# EAGLE design witch-phase2a (EAGLE 6.4)

## Sheet 1 of 7
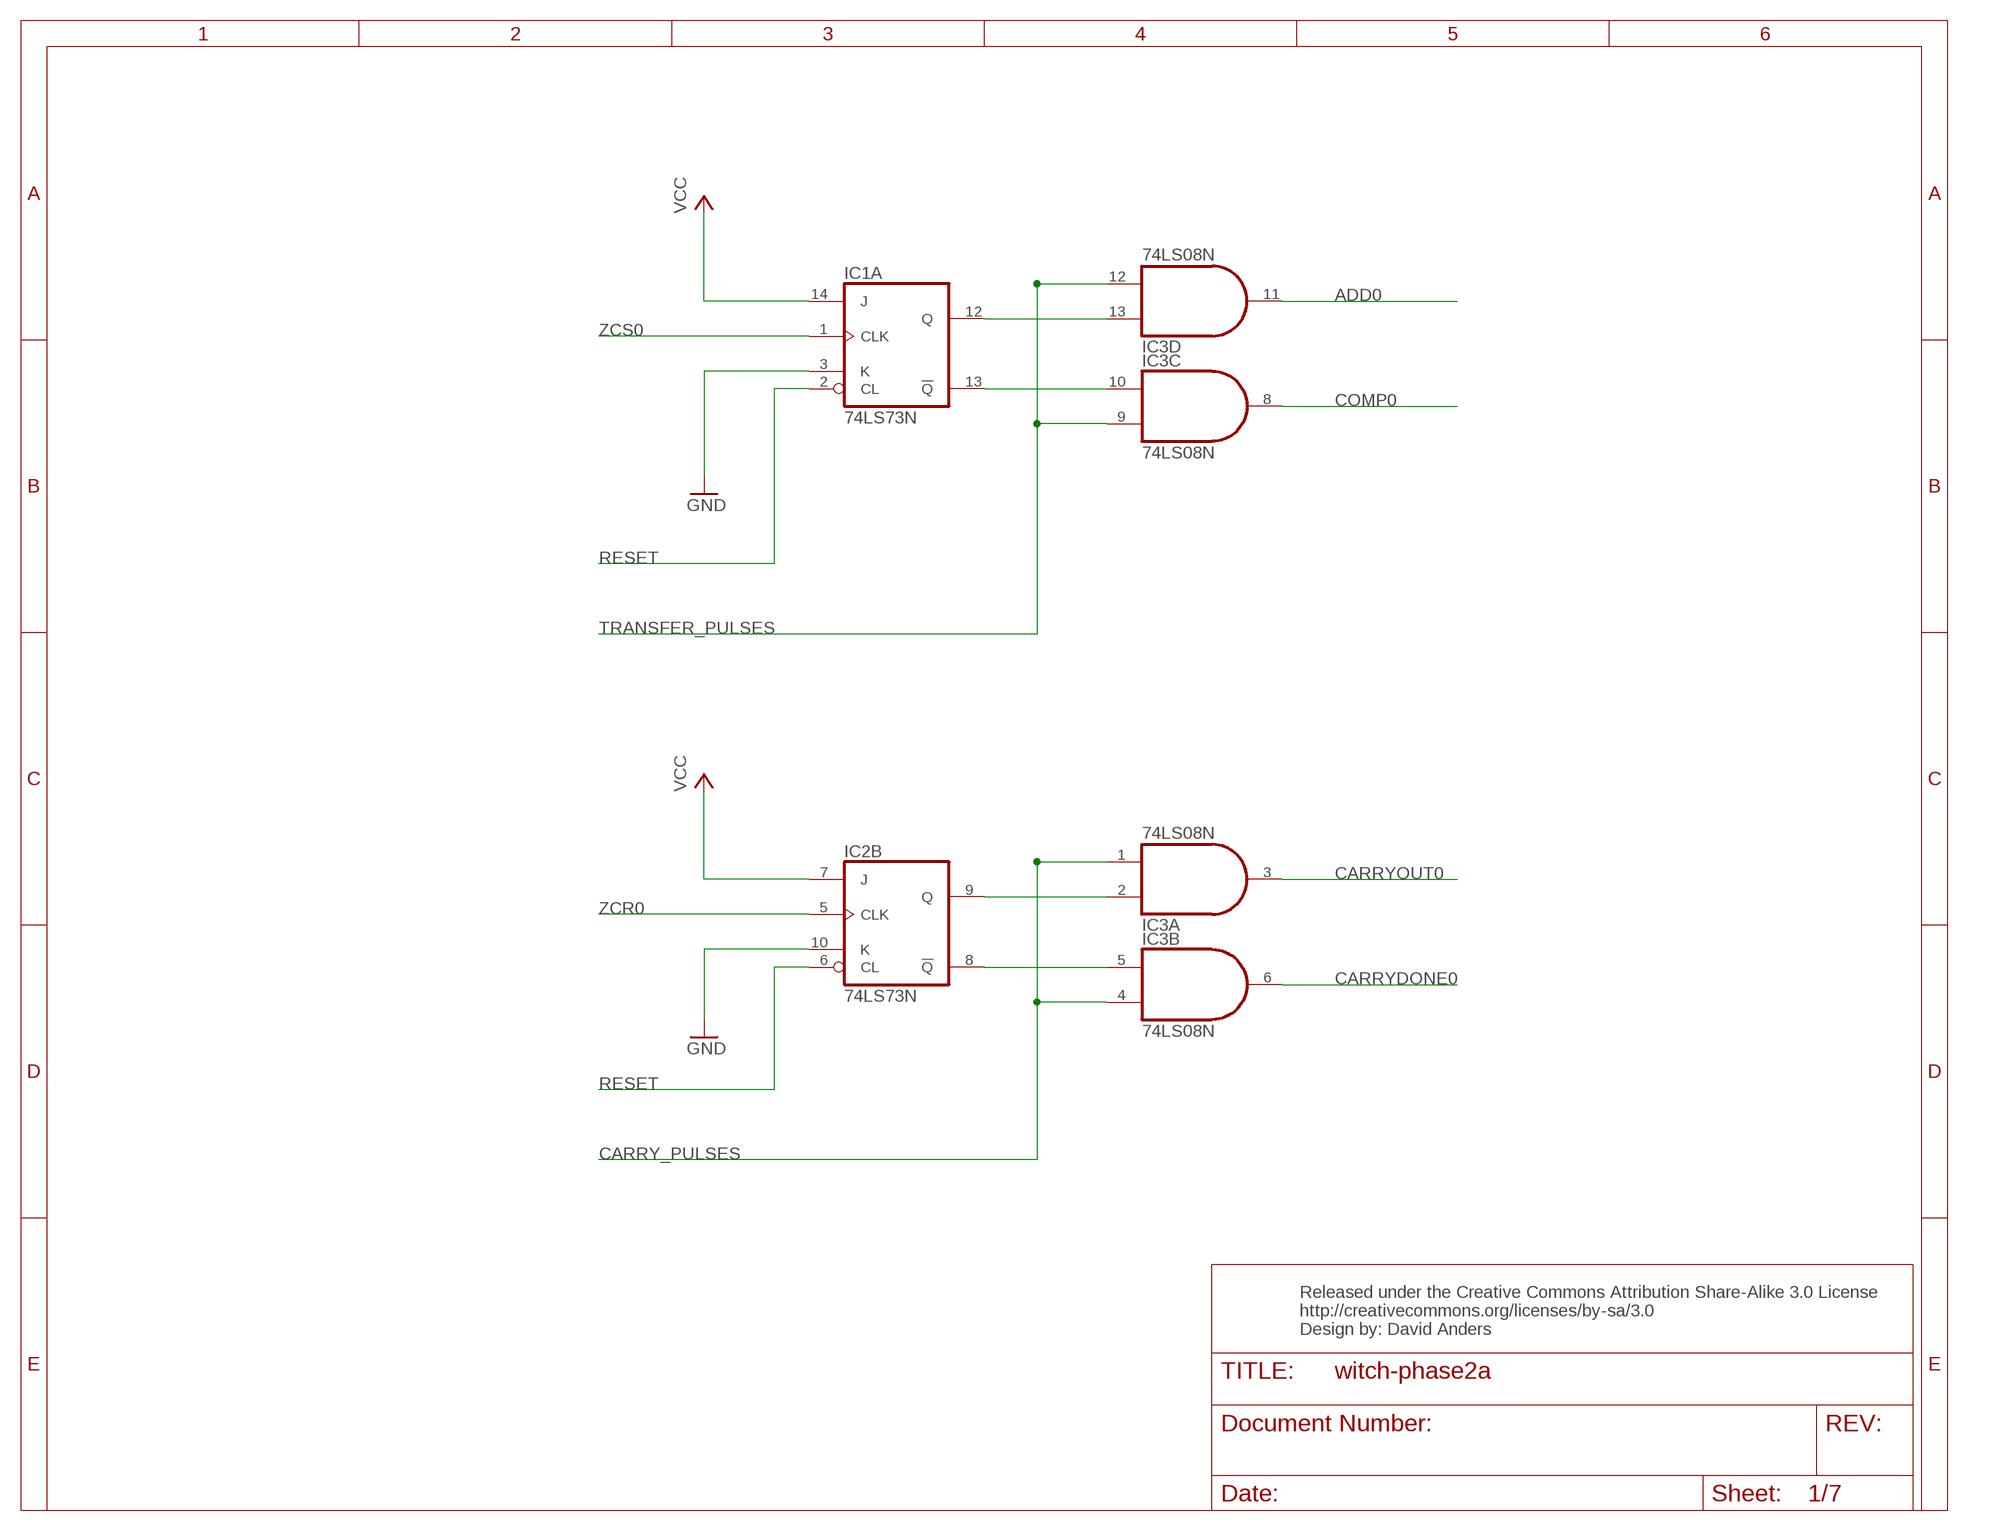
[diagram p0: schematic, sheet 1]

### Parts
IC1  74LS73N  [DIL14]
IC2  74LS73N  [DIL14]
IC3  74LS08N  [DIL14]

### Nets
ADD0: IC3.11(D:O) ; also sheet 6
CARRY_PULSES: IC3.1(A:I0) IC3.4(B:I0) ; also sheet 2,3,4,7
CARRYDONE0: IC3.6(B:O) ; also sheet 7
CARRYOUT0: IC3.3(A:O) ; also sheet 6
COMP0: IC3.8(C:O) ; also sheet 5,6
GND: IC1.3(A:K) IC2.10(B:K) ; also sheet 2,3,4,5,6,7
N$1: IC2.9(B:Q) IC3.2(A:I1)
N$2: IC2.8(B:!Q) IC3.5(B:I1)
N$4: IC1.12(A:Q) IC3.13(D:I1)
N$5: IC1.13(A:!Q) IC3.10(C:I1)
RESET: IC1.2(A:CL) IC2.6(B:CL) ; also sheet 2,3,4,7
TRANSFER_PULSES: IC3.9(C:I0) IC3.12(D:I0) ; also sheet 2,3,4,7
VCC: IC1.14(A:J) IC2.7(B:J) ; also sheet 2,3,4,5,6,7
ZCR0: IC2.5(B:CLK) ; also sheet 6
ZCS0: IC1.1(A:CLK) ; also sheet 5

### Notes on the sheet
- Released under the Creative Commons Attribution Share-Alike 3.0 License
  http://creativecommons.org/licenses/by-sa/3.0
  Design by: David Anders

## Sheet 2 of 7
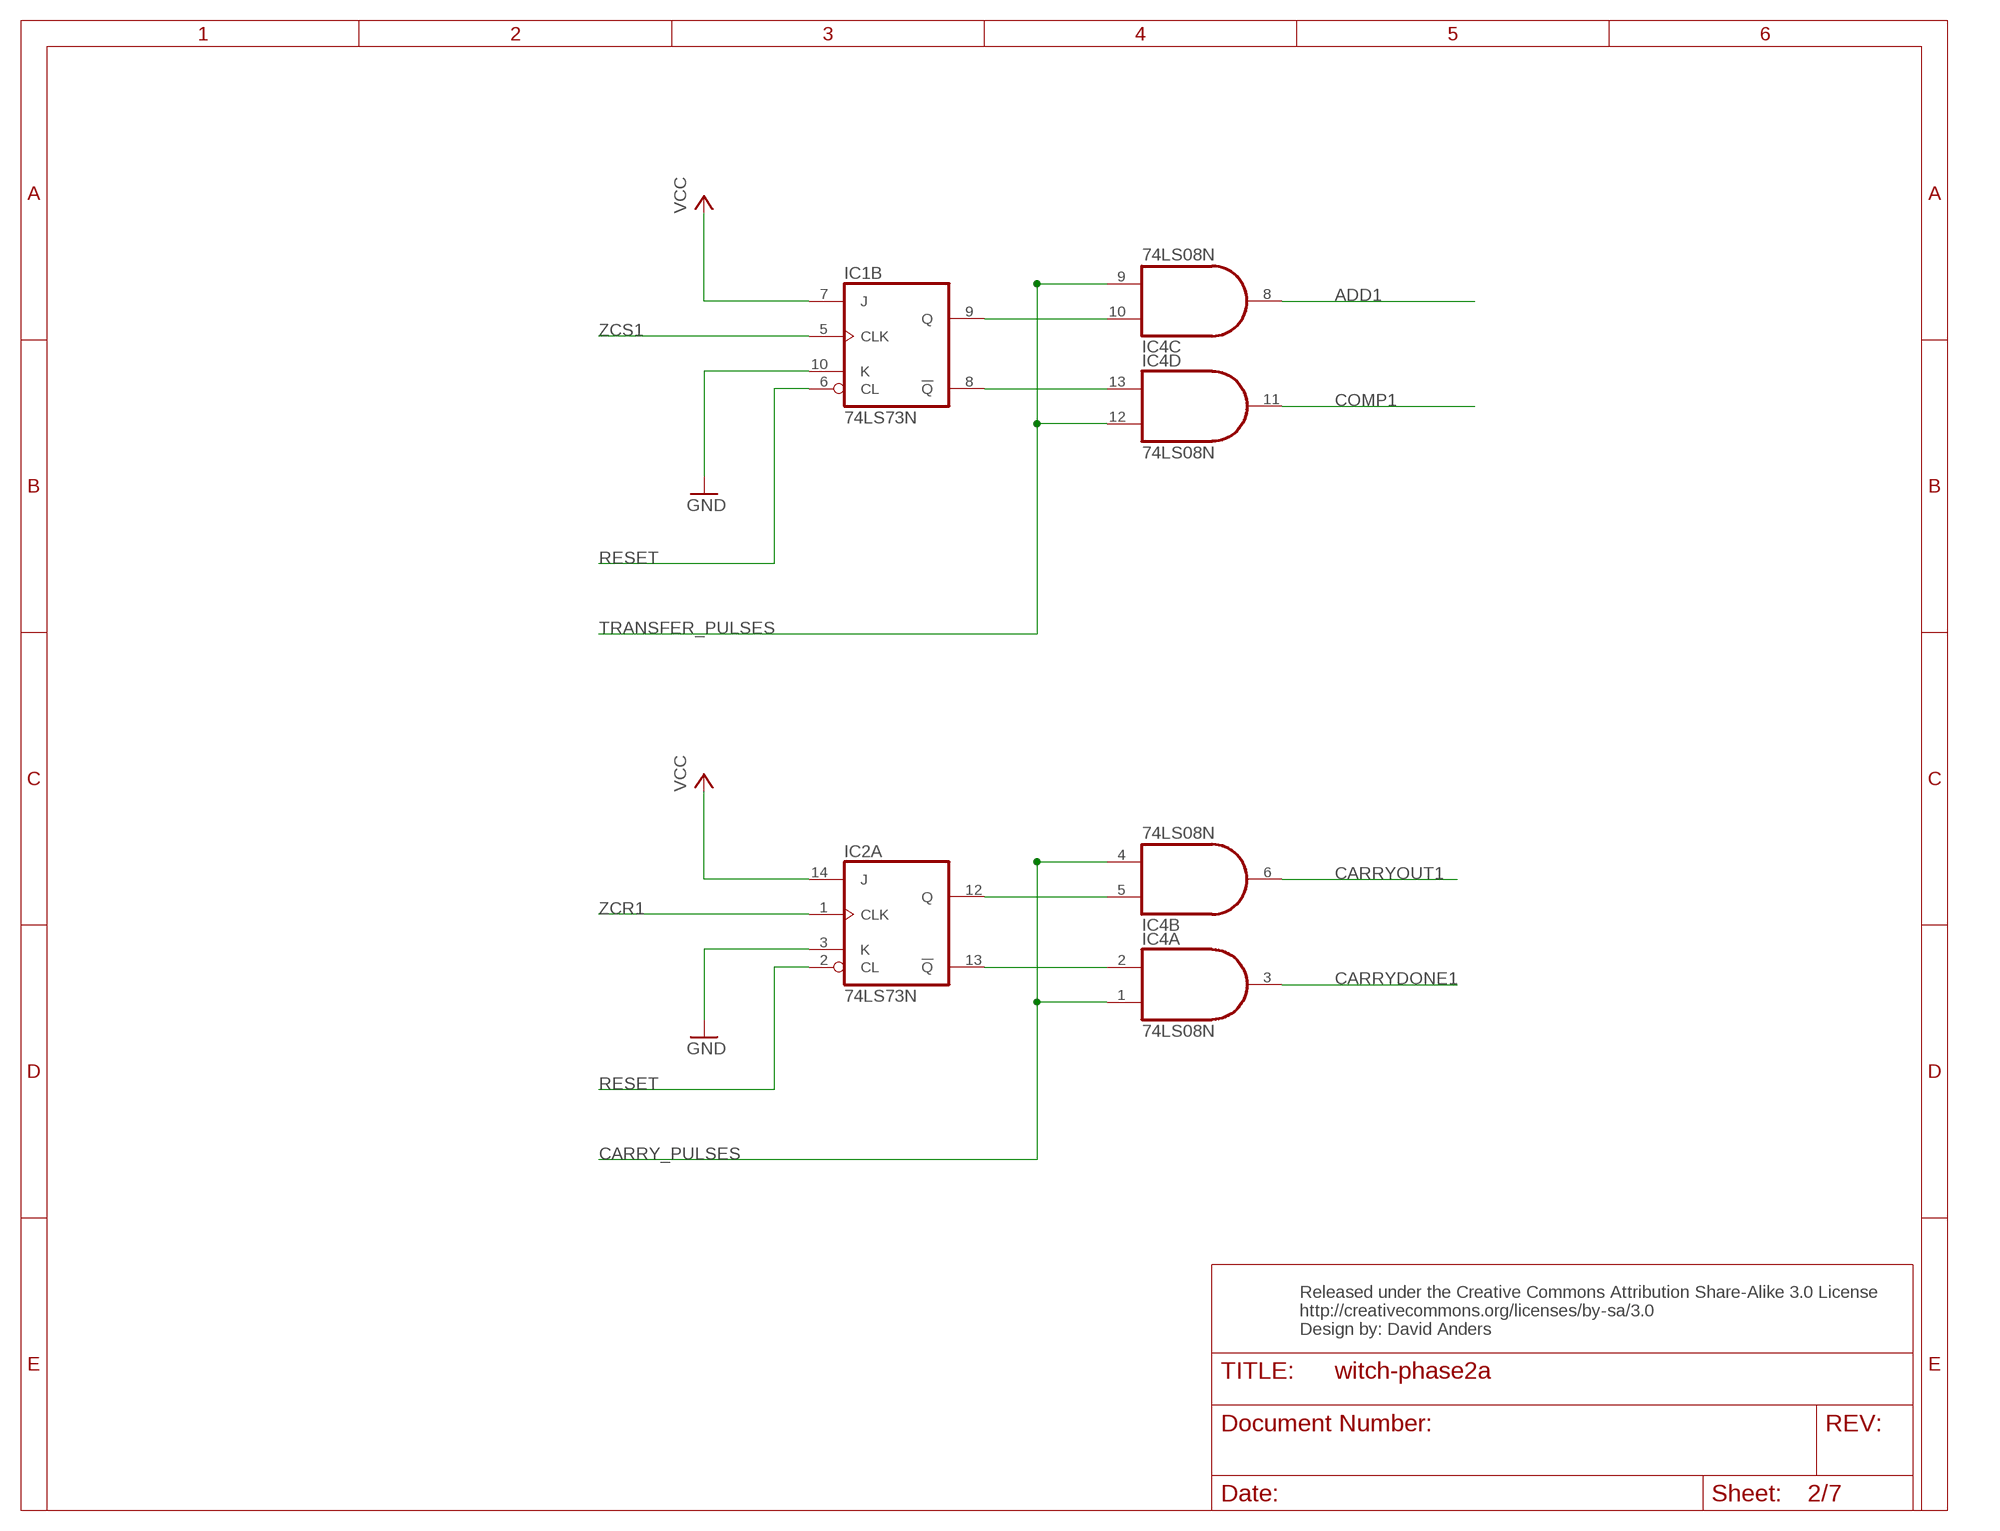
[diagram p1: schematic, sheet 2]

### Parts
IC4  74LS08N  [DIL14]

### Nets
ADD1: IC4.8(C:O) ; also sheet 6
CARRY_PULSES: IC4.1(A:I0) IC4.4(B:I0) ; also sheet 1,3,4,7
CARRYDONE1: IC4.3(A:O) ; also sheet 7
CARRYOUT1: IC4.6(B:O) ; also sheet 6
COMP1: IC4.11(D:O) ; also sheet 5,6
GND: IC1.10(B:K) IC2.3(A:K) ; also sheet 1,3,4,5,6,7
N$3: IC2.12(A:Q) IC4.5(B:I1)
N$6: IC2.13(A:!Q) IC4.2(A:I1)
N$7: IC1.8(B:!Q) IC4.13(D:I1)
N$8: IC1.9(B:Q) IC4.10(C:I1)
RESET: IC1.6(B:CL) IC2.2(A:CL) ; also sheet 1,3,4,7
TRANSFER_PULSES: IC4.9(C:I0) IC4.12(D:I0) ; also sheet 1,3,4,7
VCC: IC1.7(B:J) IC2.14(A:J) ; also sheet 1,3,4,5,6,7
ZCR1: IC2.1(A:CLK) ; also sheet 6
ZCS1: IC1.5(B:CLK) ; also sheet 5

### Notes on the sheet
- Released under the Creative Commons Attribution Share-Alike 3.0 License
  http://creativecommons.org/licenses/by-sa/3.0
  Design by: David Anders

## Sheet 3 of 7
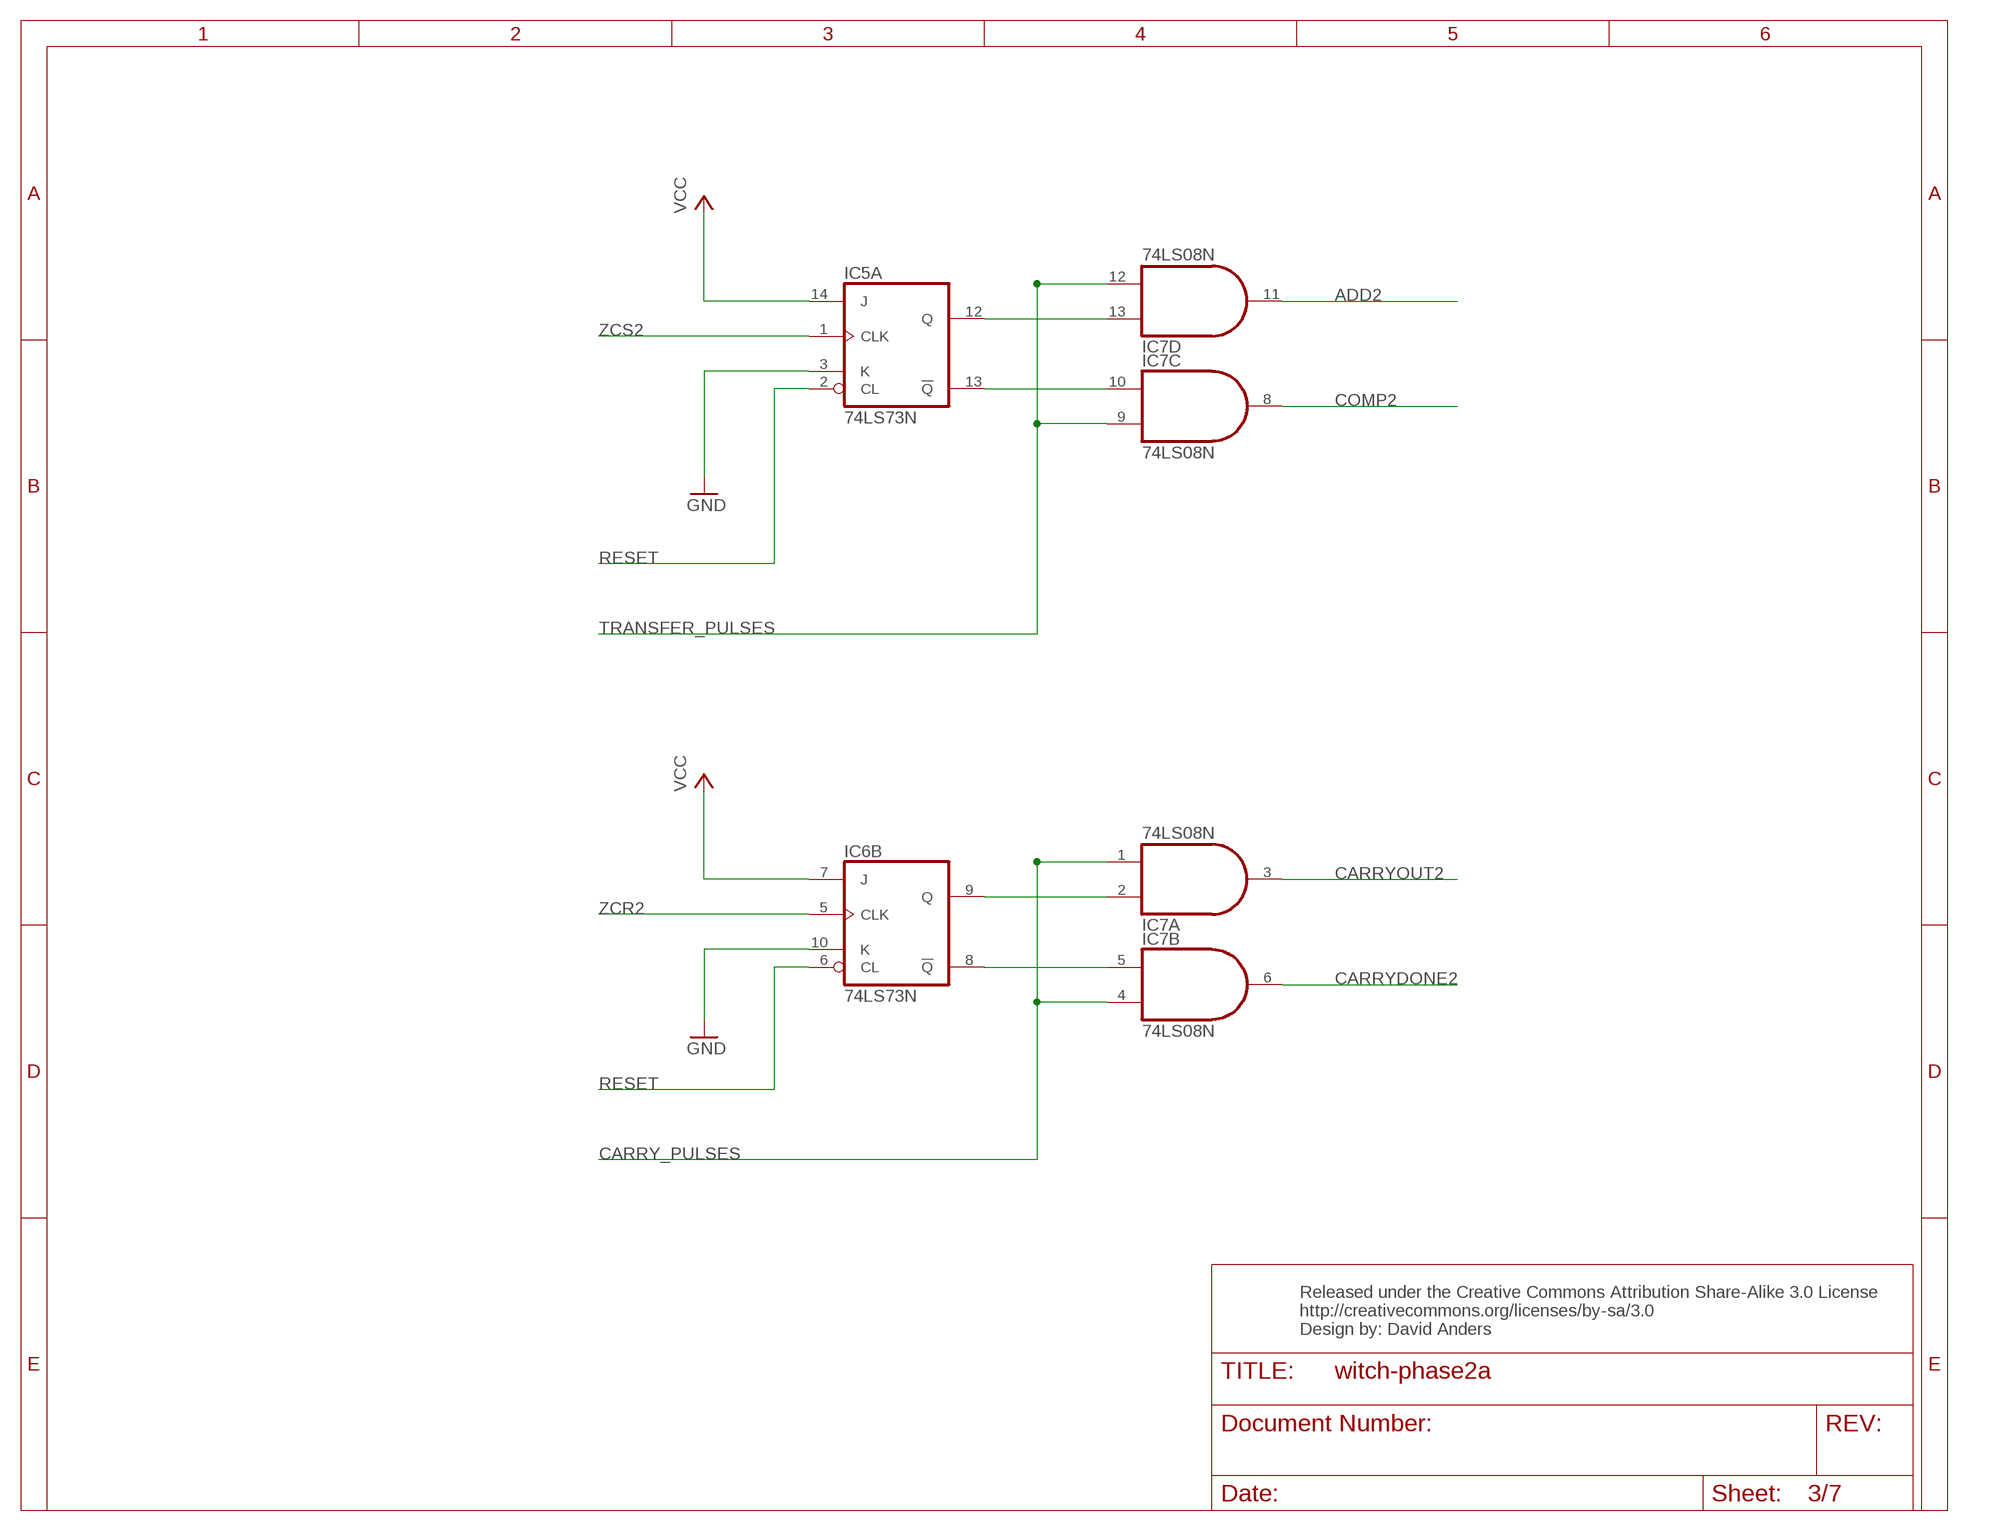
[diagram p2: schematic, sheet 3]

### Parts
IC5  74LS73N  [DIL14]
IC6  74LS73N  [DIL14]
IC7  74LS08N  [DIL14]

### Nets
ADD2: IC7.11(D:O) ; also sheet 6
CARRY_PULSES: IC7.1(A:I0) IC7.4(B:I0) ; also sheet 1,2,4,7
CARRYDONE2: IC7.6(B:O) ; also sheet 7
CARRYOUT2: IC7.3(A:O) ; also sheet 6
COMP2: IC7.8(C:O) ; also sheet 5,6
GND: IC5.3(A:K) IC6.10(B:K) ; also sheet 1,2,4,5,6,7
N$9: IC6.8(B:!Q) IC7.5(B:I1)
N$10: IC5.13(A:!Q) IC7.10(C:I1)
N$11: IC5.12(A:Q) IC7.13(D:I1)
N$12: IC6.9(B:Q) IC7.2(A:I1)
RESET: IC5.2(A:CL) IC6.6(B:CL) ; also sheet 1,2,4,7
TRANSFER_PULSES: IC7.9(C:I0) IC7.12(D:I0) ; also sheet 1,2,4,7
VCC: IC5.14(A:J) IC6.7(B:J) ; also sheet 1,2,4,5,6,7
ZCR2: IC6.5(B:CLK) ; also sheet 6
ZCS2: IC5.1(A:CLK) ; also sheet 5

### Notes on the sheet
- Released under the Creative Commons Attribution Share-Alike 3.0 License
  http://creativecommons.org/licenses/by-sa/3.0
  Design by: David Anders

## Sheet 4 of 7
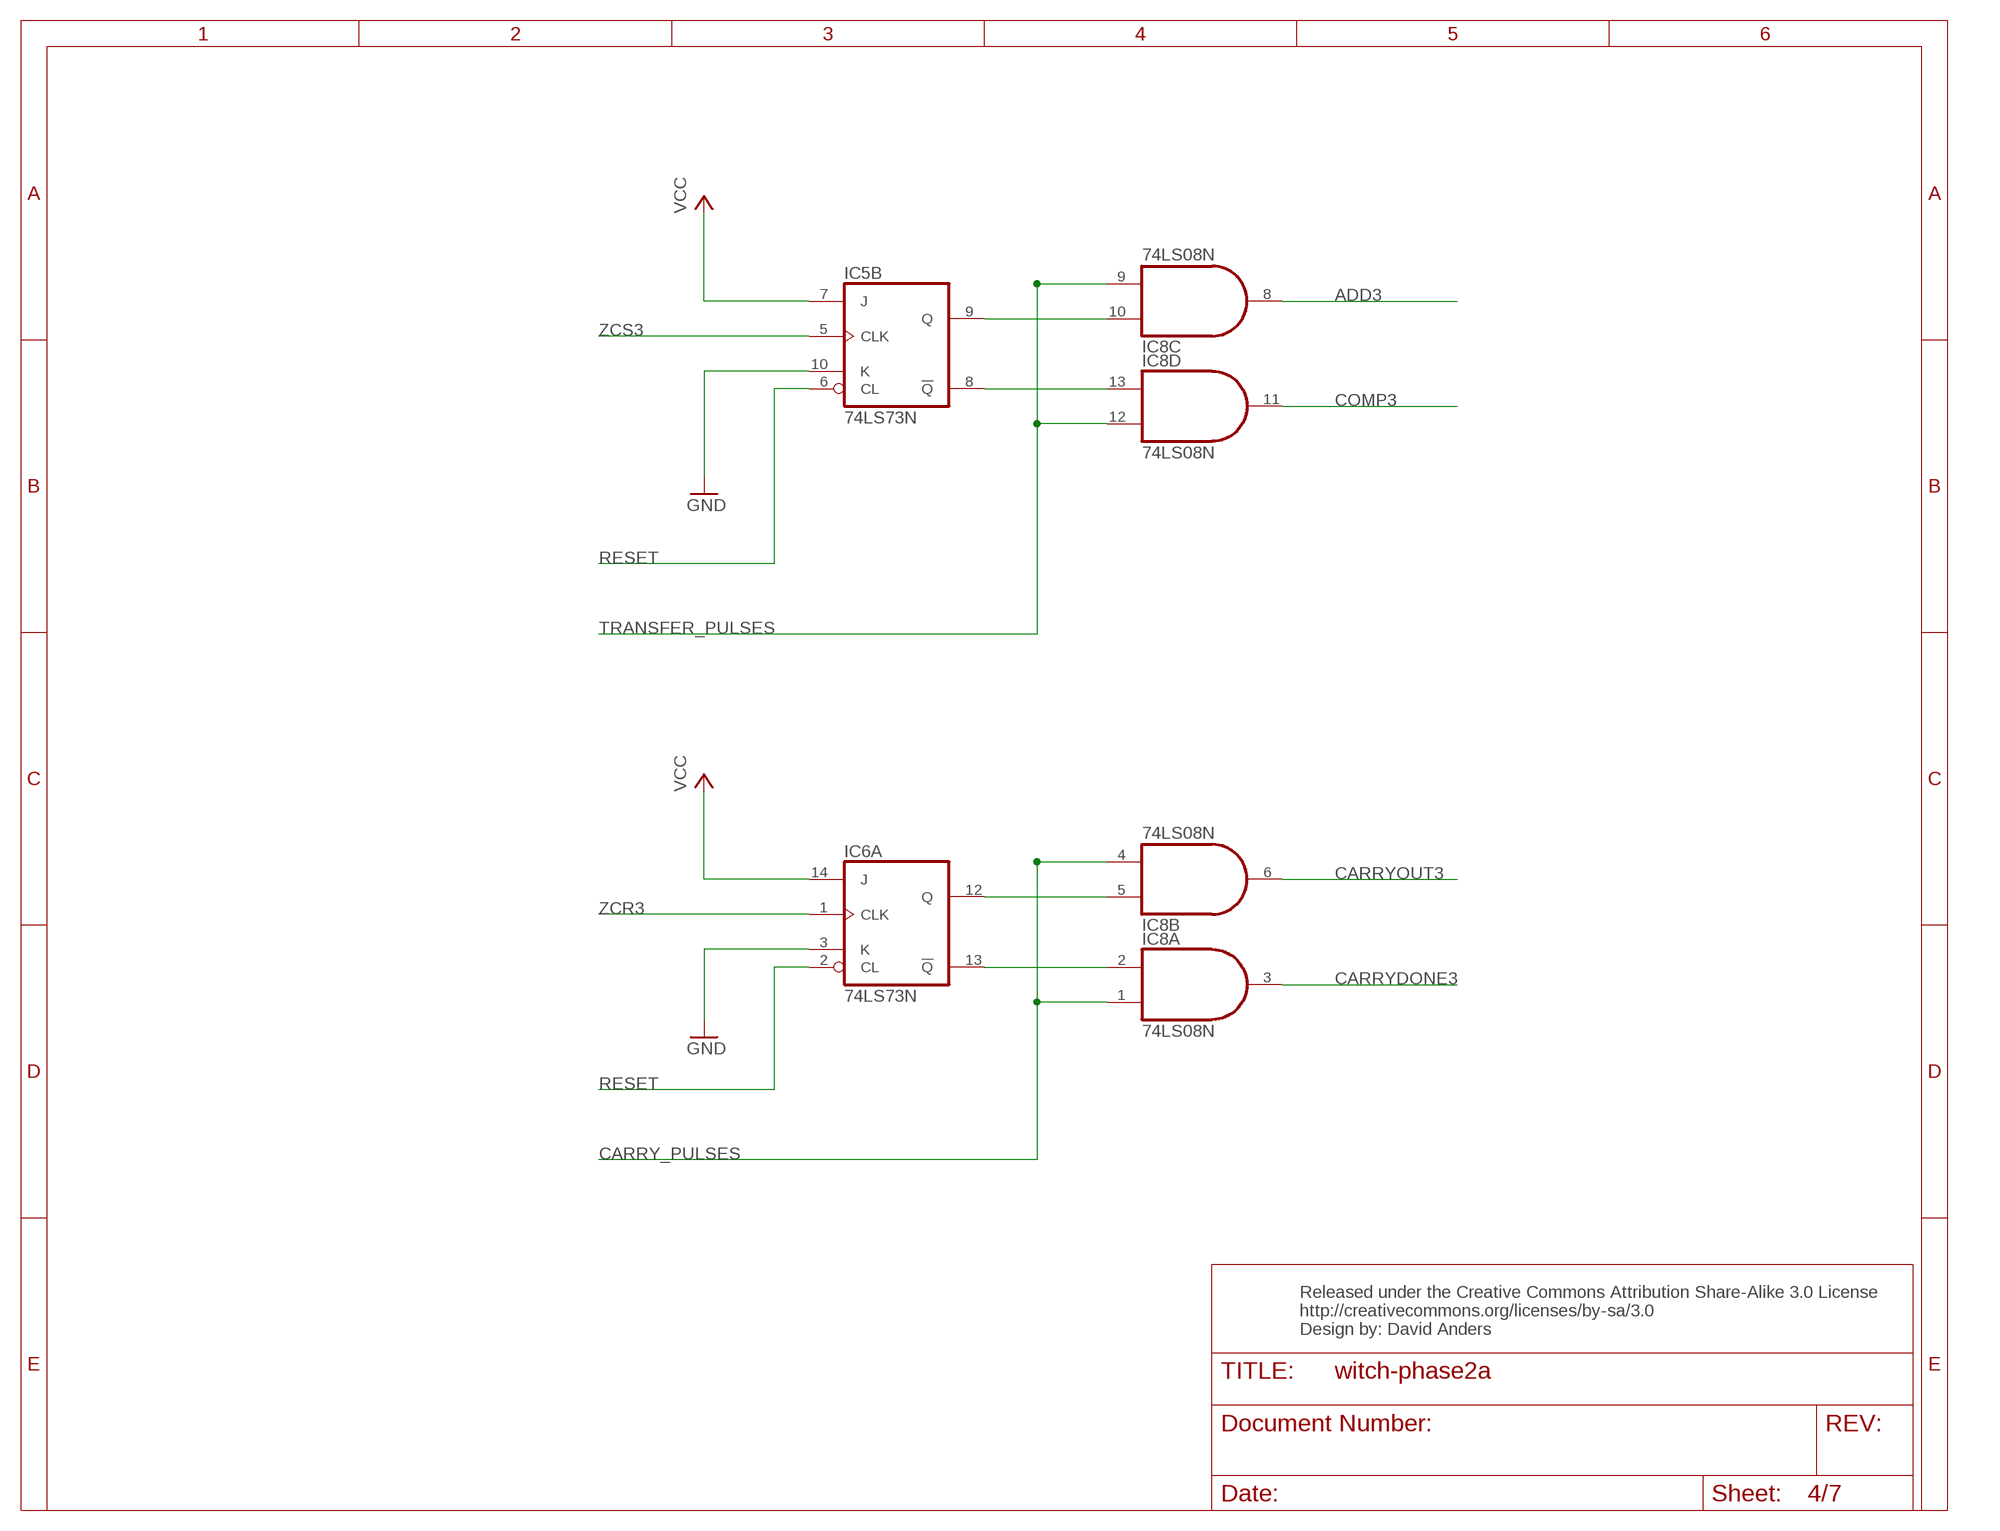
[diagram p3: schematic, sheet 4]

### Parts
IC8  74LS08N  [DIL14]

### Nets
ADD3: IC8.8(C:O) ; also sheet 6
CARRY_PULSES: IC8.1(A:I0) IC8.4(B:I0) ; also sheet 1,2,3,7
CARRYDONE3: IC8.3(A:O) ; also sheet 7
CARRYOUT3: IC8.6(B:O) ; also sheet 6
COMP3: IC8.11(D:O) ; also sheet 5,6
GND: IC5.10(B:K) IC6.3(A:K) ; also sheet 1,2,3,5,6,7
N$13: IC6.13(A:!Q) IC8.2(A:I1)
N$14: IC5.8(B:!Q) IC8.13(D:I1)
N$15: IC5.9(B:Q) IC8.10(C:I1)
N$16: IC6.12(A:Q) IC8.5(B:I1)
RESET: IC5.6(B:CL) IC6.2(A:CL) ; also sheet 1,2,3,7
TRANSFER_PULSES: IC8.9(C:I0) IC8.12(D:I0) ; also sheet 1,2,3,7
VCC: IC5.7(B:J) IC6.14(A:J) ; also sheet 1,2,3,5,6,7
ZCR3: IC6.1(A:CLK) ; also sheet 6
ZCS3: IC5.5(B:CLK) ; also sheet 5

### Notes on the sheet
- Released under the Creative Commons Attribution Share-Alike 3.0 License
  http://creativecommons.org/licenses/by-sa/3.0
  Design by: David Anders

## Sheet 5 of 7
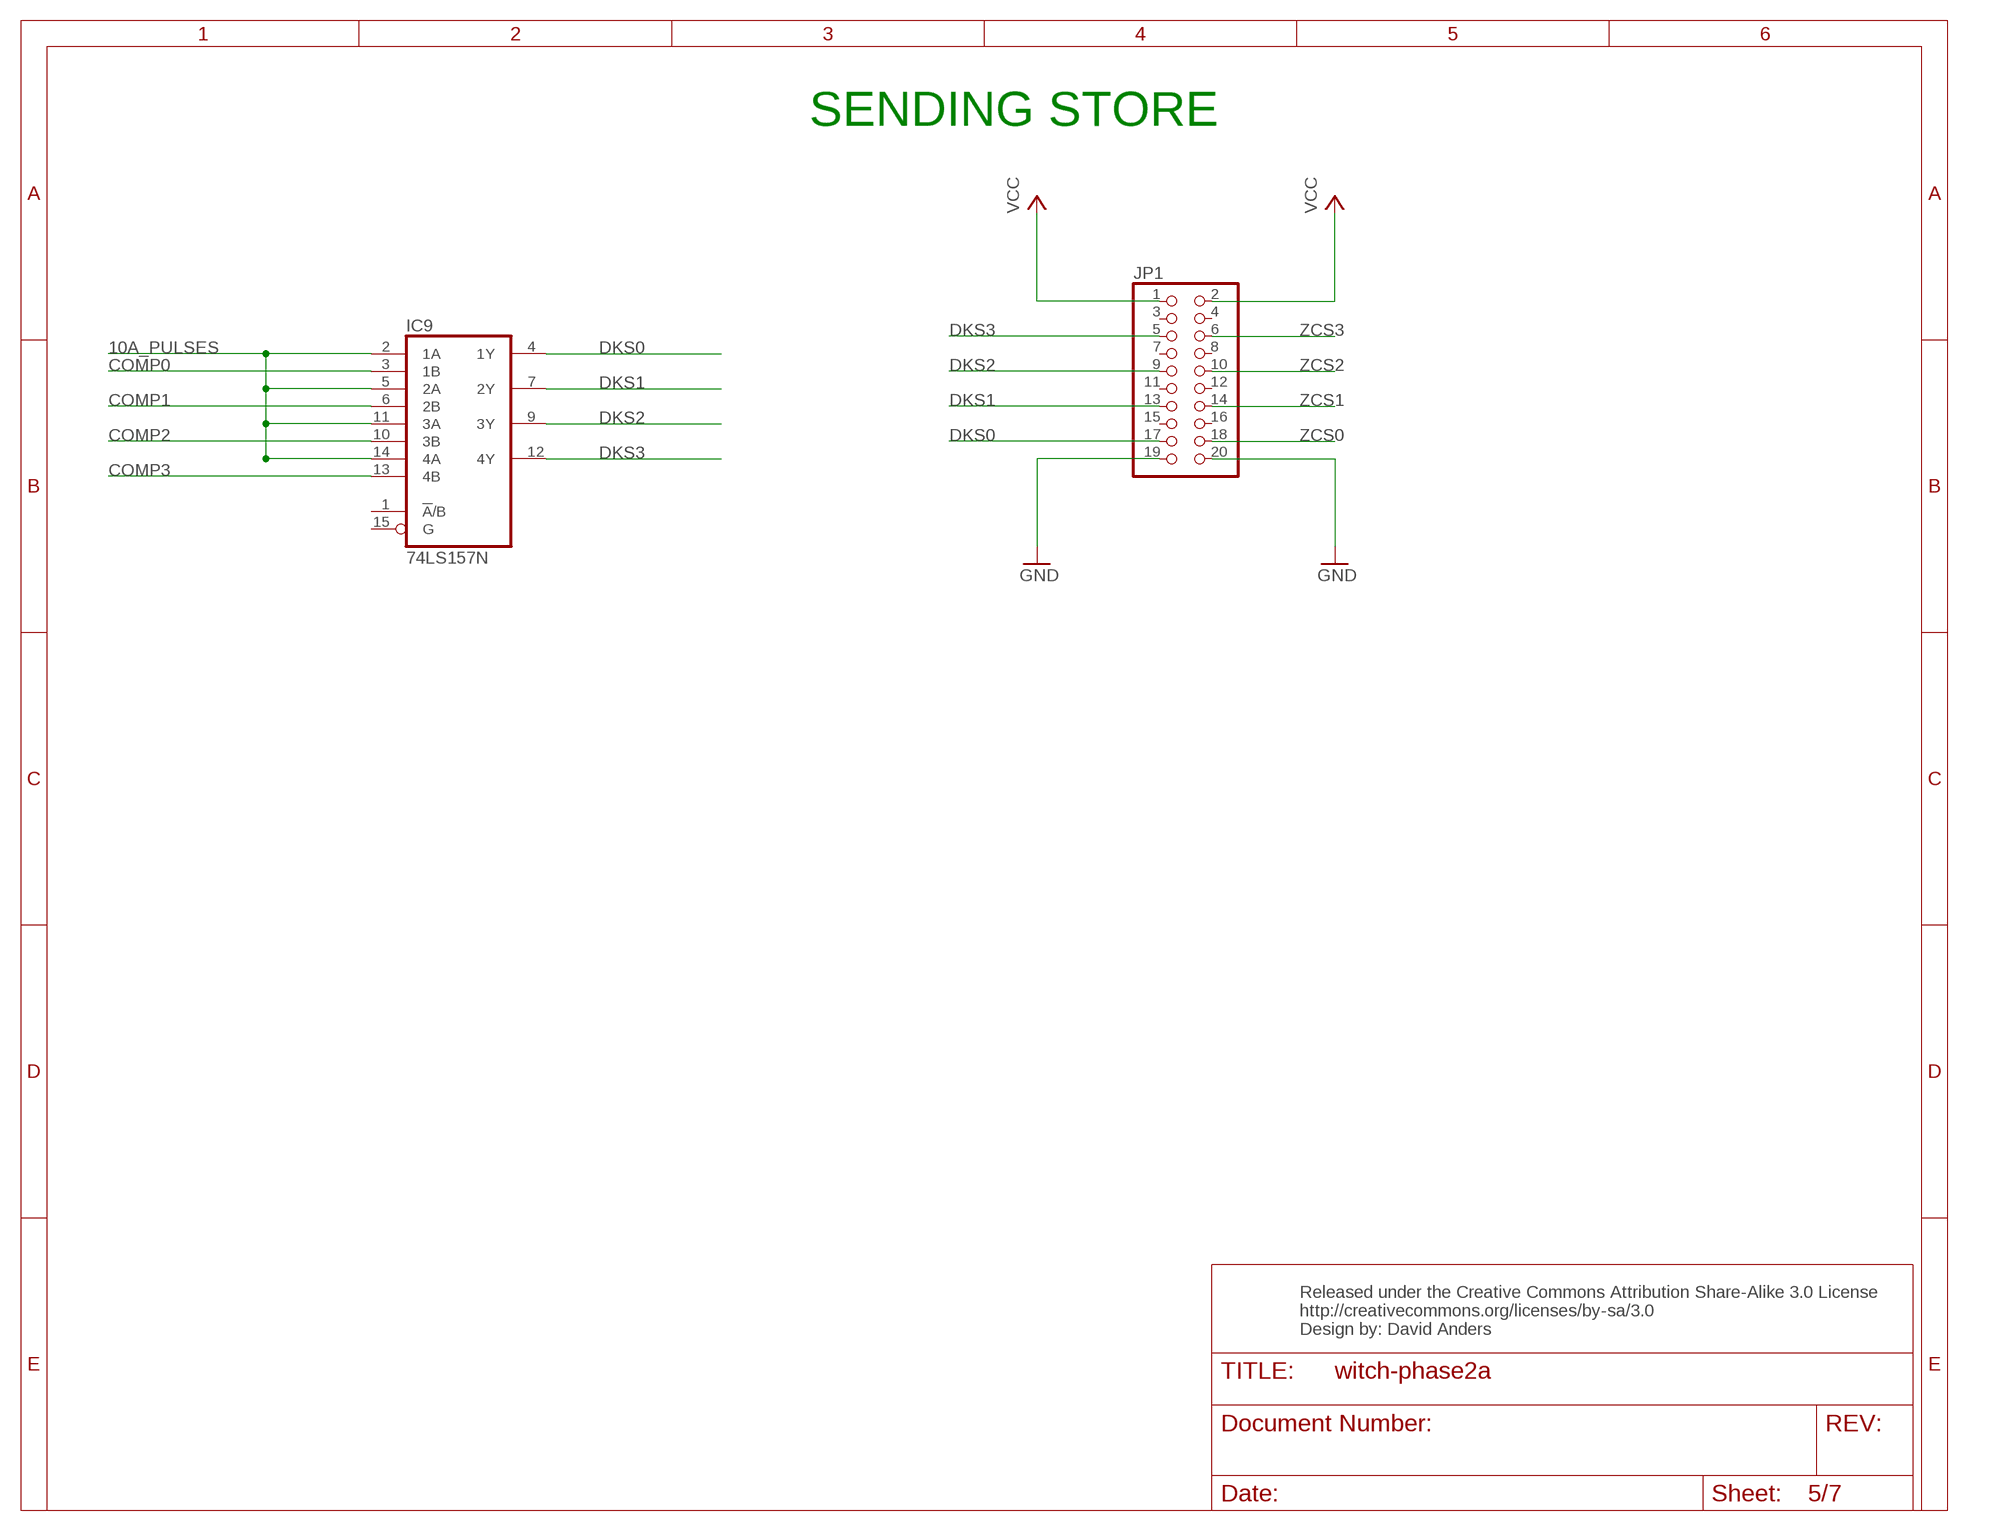
[diagram p4: schematic, sheet 5]

### Parts
IC9  74LS157N  [DIL16]
JP1  PINHD-2X10  [2X10]

### Nets
10A_PULSES: IC9.2(1A) IC9.5(2A) IC9.11(3A) IC9.14(4A) ; also sheet 7
COMP0: IC9.3(1B) ; also sheet 1,6
COMP1: IC9.6(2B) ; also sheet 2,6
COMP2: IC9.10(3B) ; also sheet 3,6
COMP3: IC9.13(4B) ; also sheet 4,6
DKS0: IC9.4(1Y) JP1.17
DKS1: IC9.7(2Y) JP1.13
DKS2: IC9.9(3Y) JP1.9
DKS3: IC9.12(4Y) JP1.5
GND: JP1.19 JP1.20 ; also sheet 1,2,3,4,6,7
VCC: JP1.1 JP1.2 ; also sheet 1,2,3,4,6,7
ZCS0: JP1.18 ; also sheet 1
ZCS1: JP1.14 ; also sheet 2
ZCS2: JP1.10 ; also sheet 3
ZCS3: JP1.6 ; also sheet 4
Unconnected: IC9.1(!A!/B) IC9.15(G) JP1.3 JP1.4 JP1.7 JP1.8 JP1.11 JP1.12 JP1.15 JP1.16

### Notes on the sheet
- SENDING STORE
- Released under the Creative Commons Attribution Share-Alike 3.0 License
  http://creativecommons.org/licenses/by-sa/3.0
  Design by: David Anders

## Sheet 6 of 7
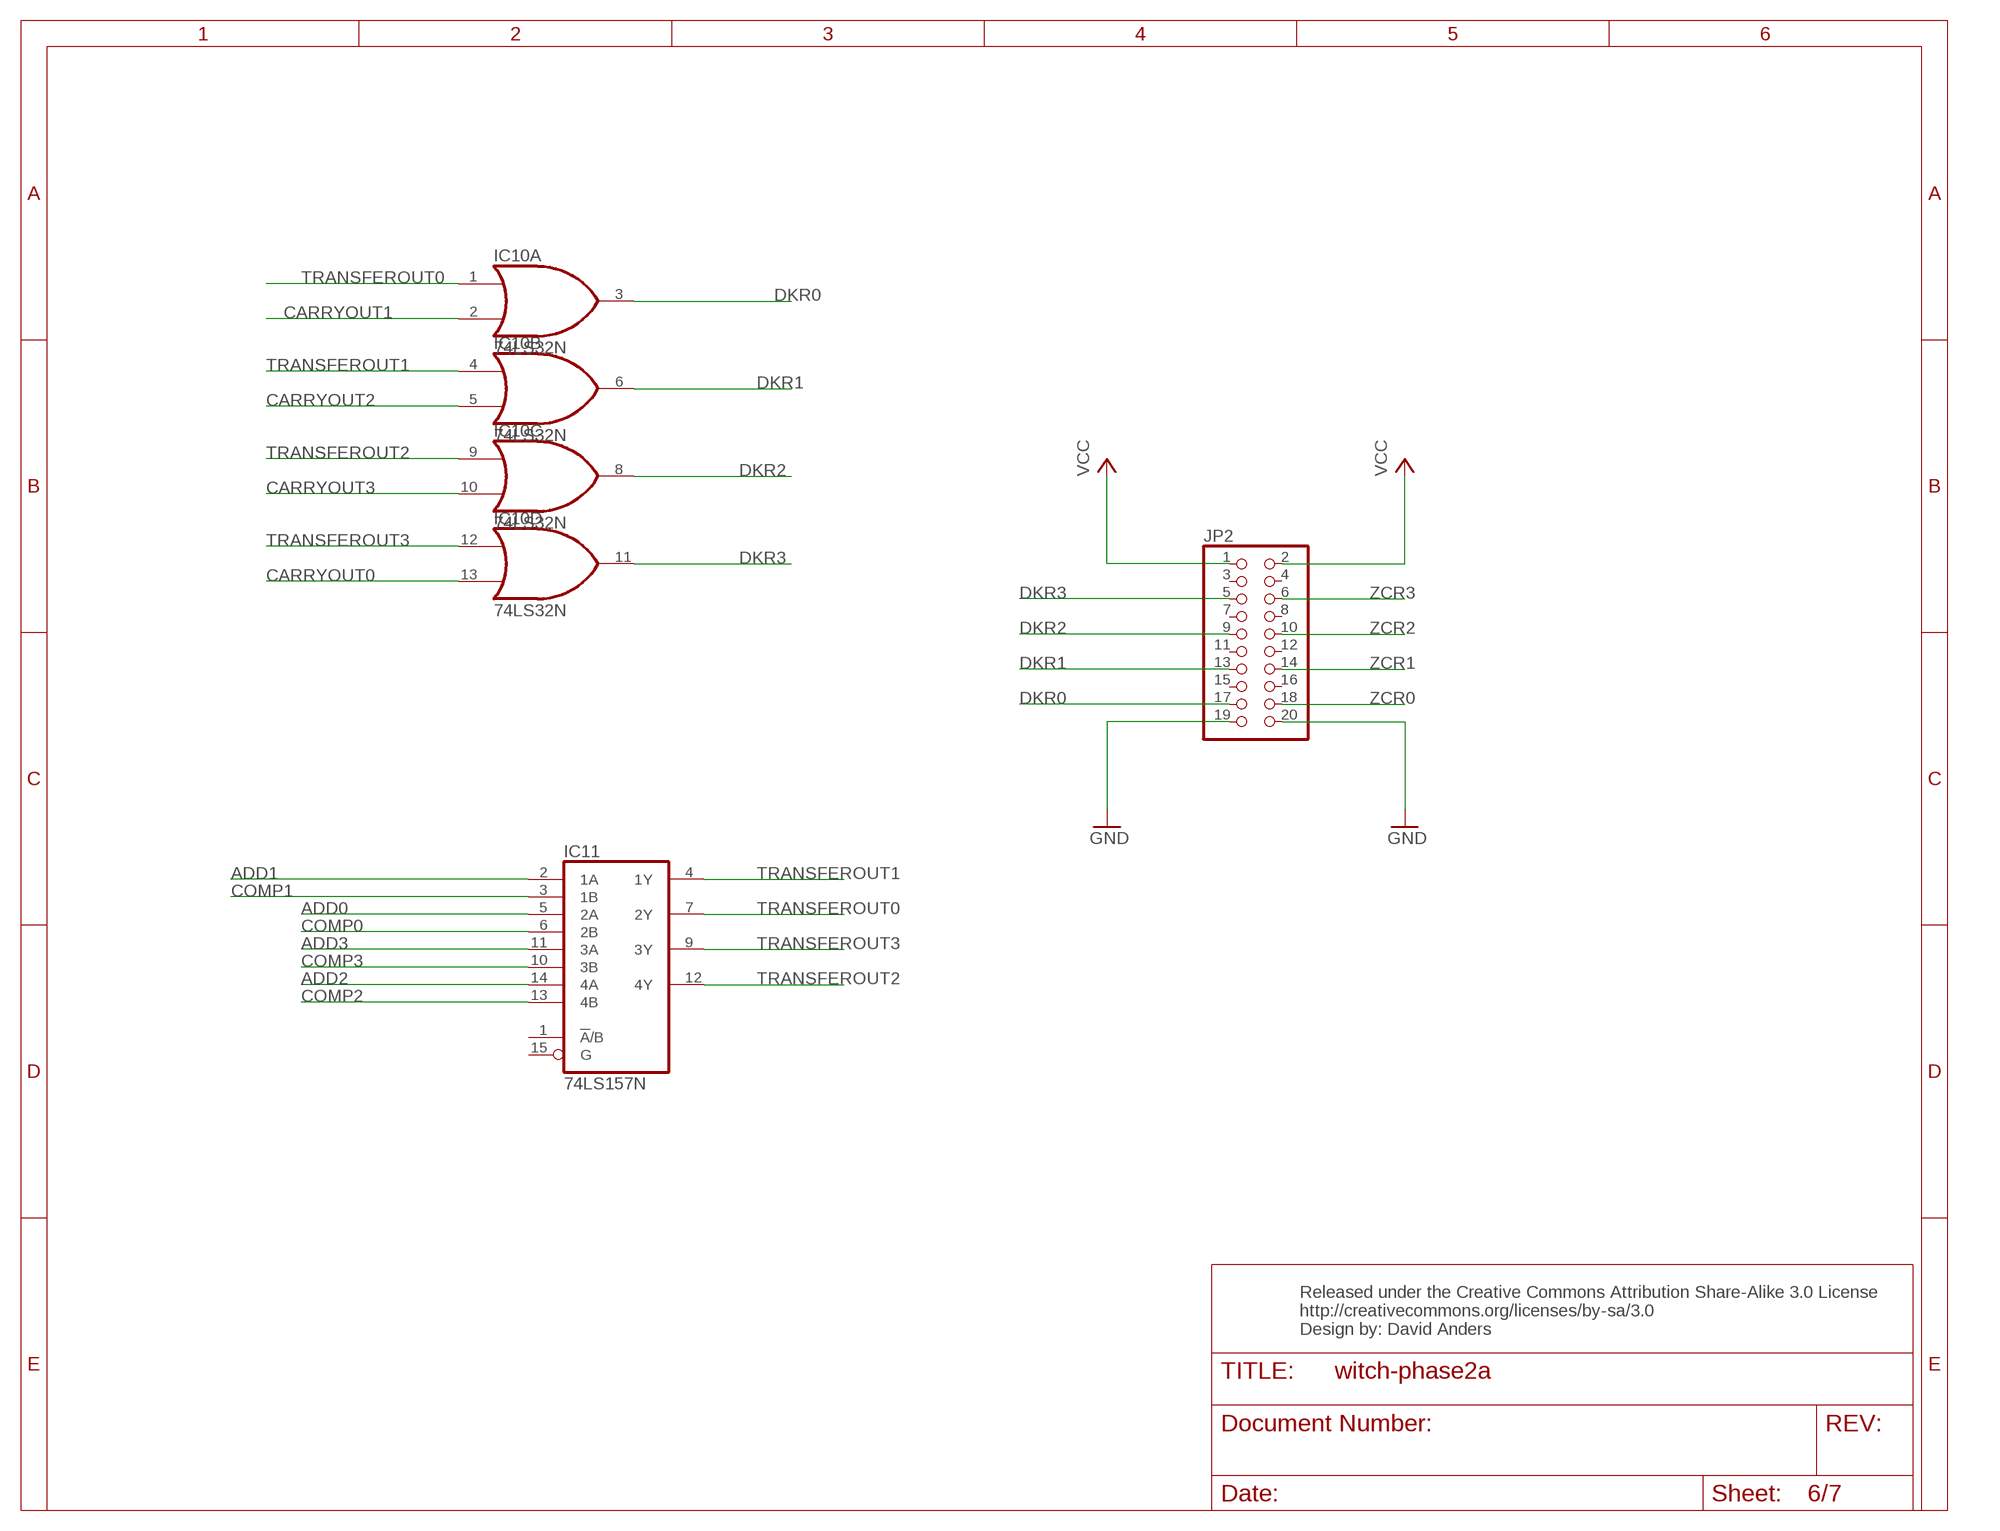
[diagram p5: schematic, sheet 6]

### Parts
IC10  74LS32N  [DIL14]
IC11  74LS157N  [DIL16]
JP2  PINHD-2X10  [2X10]

### Nets
ADD0: IC11.5(2A) ; also sheet 1
ADD1: IC11.2(1A) ; also sheet 2
ADD2: IC11.14(4A) ; also sheet 3
ADD3: IC11.11(3A) ; also sheet 4
CARRYOUT0: IC10.13(D:I1) ; also sheet 1
CARRYOUT1: IC10.2(A:I1) ; also sheet 2
CARRYOUT2: IC10.5(B:I1) ; also sheet 3
CARRYOUT3: IC10.10(C:I1) ; also sheet 4
COMP0: IC11.6(2B) ; also sheet 1,5
COMP1: IC11.3(1B) ; also sheet 2,5
COMP2: IC11.13(4B) ; also sheet 3,5
COMP3: IC11.10(3B) ; also sheet 4,5
DKR0: IC10.3(A:O) JP2.17
DKR1: IC10.6(B:O) JP2.13
DKR2: IC10.8(C:O) JP2.9
DKR3: IC10.11(D:O) JP2.5
GND: JP2.19 JP2.20 ; also sheet 1,2,3,4,5,7
TRANSFEROUT0: IC10.1(A:I0) IC11.7(2Y)
TRANSFEROUT1: IC10.4(B:I0) IC11.4(1Y)
TRANSFEROUT2: IC10.9(C:I0) IC11.12(4Y)
TRANSFEROUT3: IC10.12(D:I0) IC11.9(3Y)
VCC: JP2.1 JP2.2 ; also sheet 1,2,3,4,5,7
ZCR0: JP2.18 ; also sheet 1
ZCR1: JP2.14 ; also sheet 2
ZCR2: JP2.10 ; also sheet 3
ZCR3: JP2.6 ; also sheet 4
Unconnected: IC11.1(!A!/B) IC11.15(G) JP2.3 JP2.4 JP2.7 JP2.8 JP2.11 JP2.12 JP2.15 JP2.16

### Notes on the sheet
- Released under the Creative Commons Attribution Share-Alike 3.0 License
  http://creativecommons.org/licenses/by-sa/3.0
  Design by: David Anders

## Sheet 7 of 7
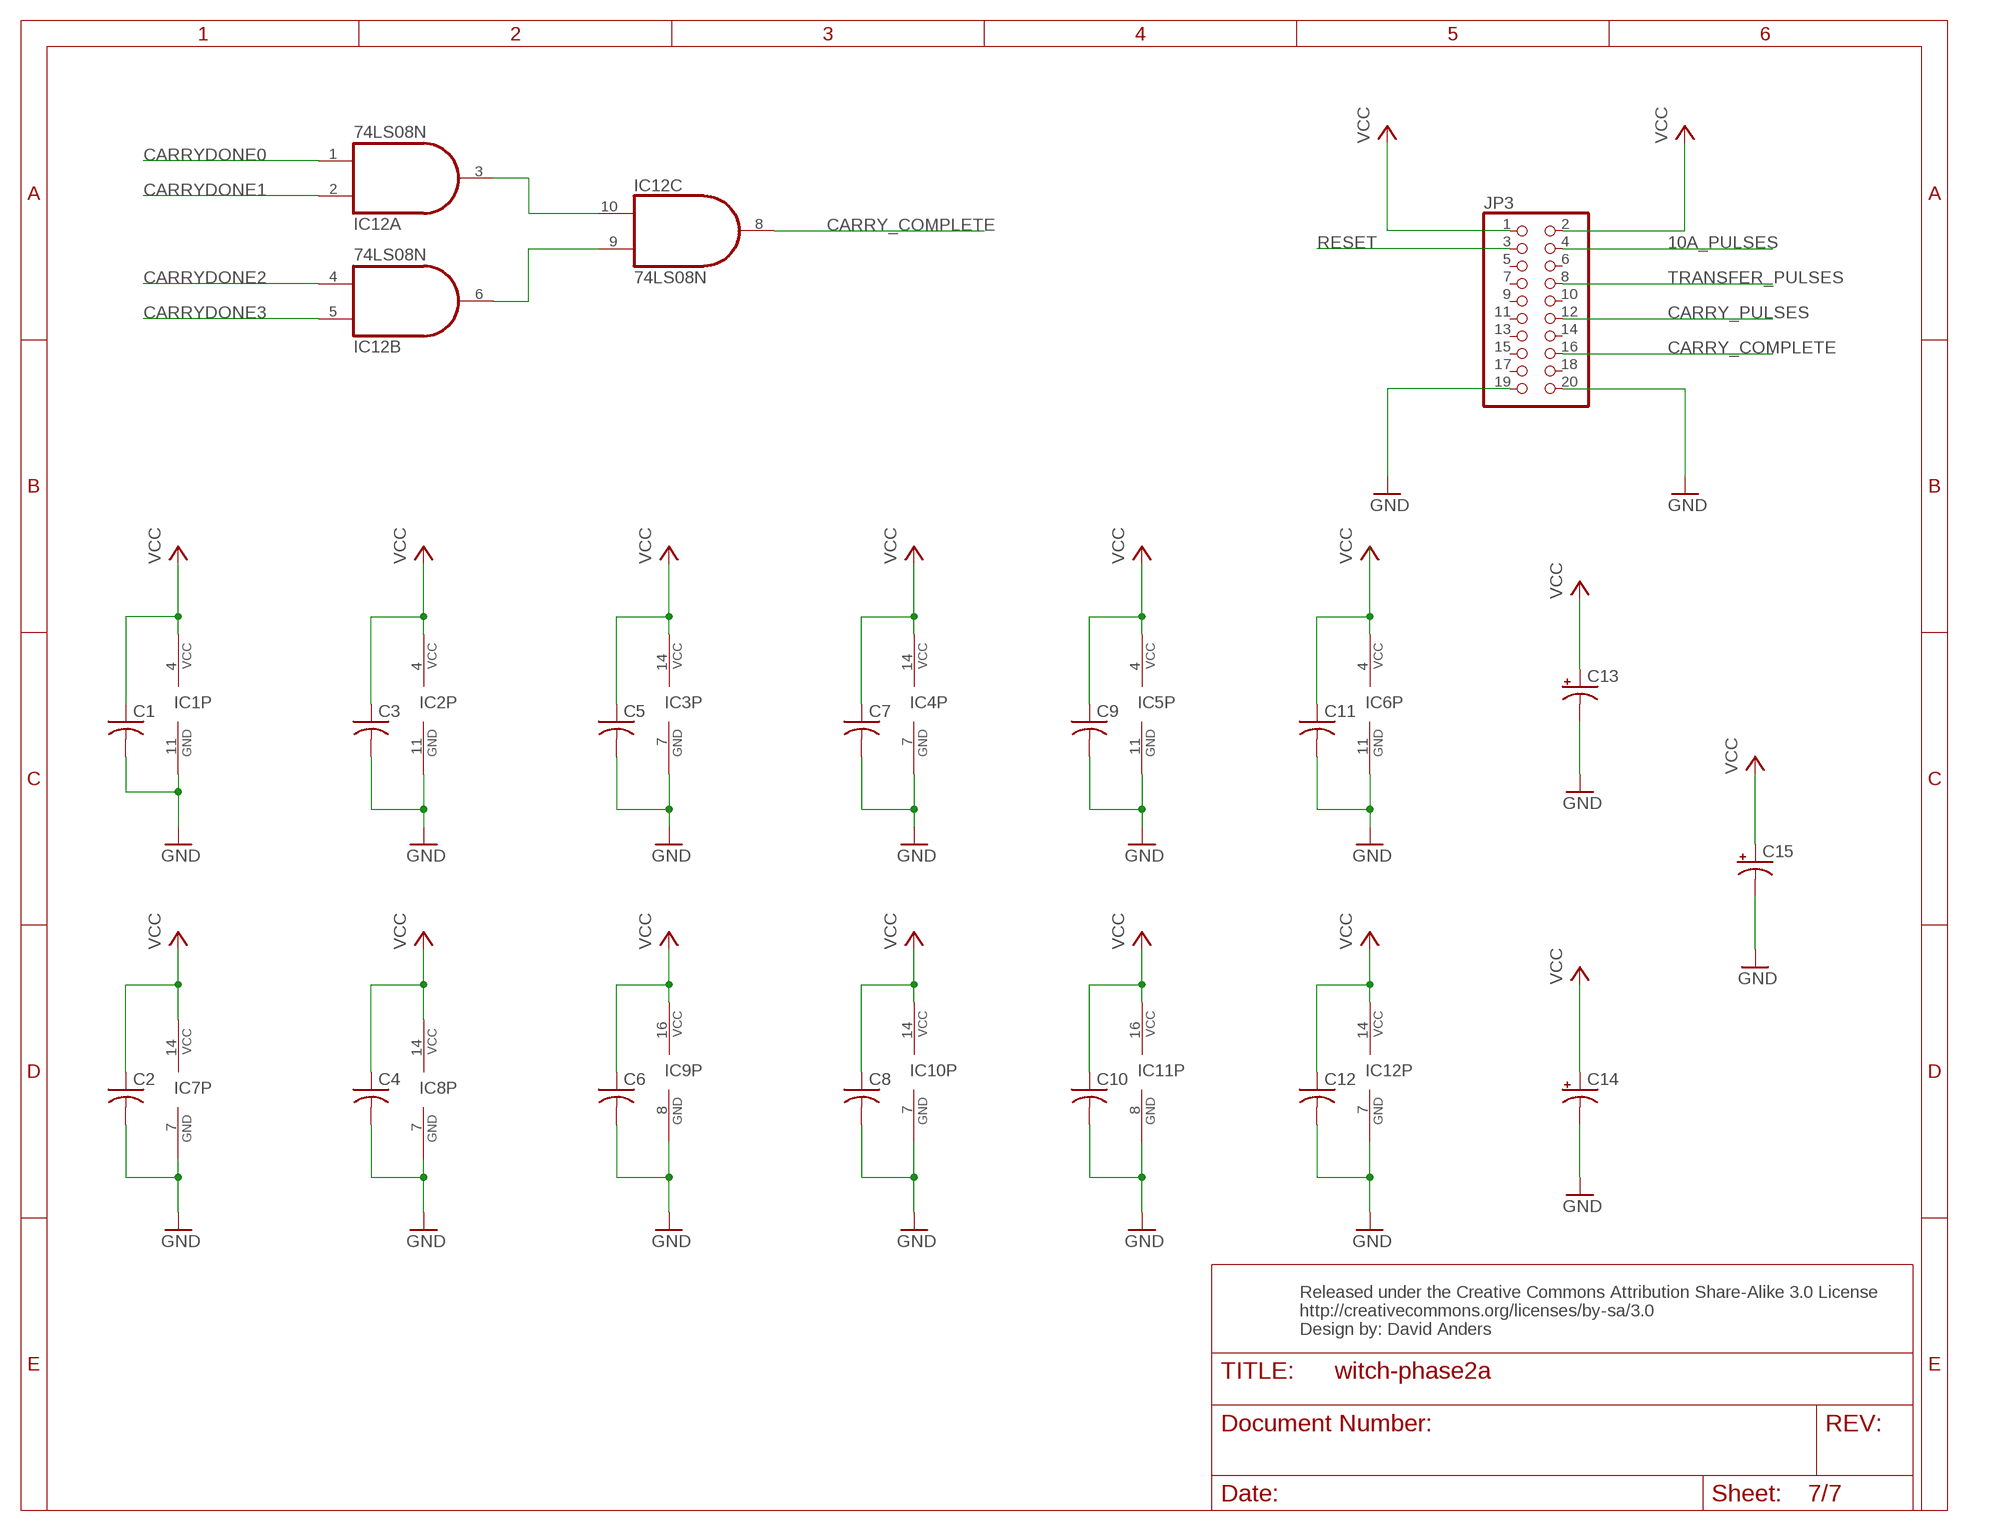
[diagram p6: schematic, sheet 7]

### Parts
C1  C-US025-025X050  [C025-025X050]
C2  C-US025-025X050  [C025-025X050]
C3  C-US025-025X050  [C025-025X050]
C4  C-US025-025X050  [C025-025X050]
C5  C-US025-025X050  [C025-025X050]
C6  C-US025-025X050  [C025-025X050]
C7  C-US025-025X050  [C025-025X050]
C8  C-US025-025X050  [C025-025X050]
C9  C-US025-025X050  [C025-025X050]
C10  C-US025-025X050  [C025-025X050]
C11  C-US025-025X050  [C025-025X050]
C12  C-US025-025X050  [C025-025X050]
C13  CPOL-USE2-5  [E2-5]
C14  CPOL-USE2-5  [E2-5]
C15  CPOL-USE2-5  [E2-5]
IC12  74LS08N  [DIL14]
JP3  PINHD-2X10  [2X10]

### Nets
10A_PULSES: JP3.4 ; also sheet 5
CARRY_COMPLETE: IC12.8(C:O) JP3.16
CARRY_PULSES: JP3.12 ; also sheet 1,2,3,4
CARRYDONE0: IC12.1(A:I0) ; also sheet 1
CARRYDONE1: IC12.2(A:I1) ; also sheet 2
CARRYDONE2: IC12.4(B:I0) ; also sheet 3
CARRYDONE3: IC12.5(B:I1) ; also sheet 4
GND: C1.2 C2.2 C3.2 C4.2 C5.2 C6.2 C7.2 C8.2 C9.2 C10.2 C11.2 C12.2 C13.- C14.- C15.- IC1.11(P:GND) IC2.11(P:GND) IC3.7(P:GND) IC4.7(P:GND) IC5.11(P:GND) IC6.11(P:GND) IC7.7(P:GND) IC8.7(P:GND) IC9.8(GND) IC10.7(P:GND) IC11.8(GND) IC12.7(P:GND) JP3.19 JP3.20 ; also sheet 1,2,3,4,5,6
N$25: IC12.3(A:O) IC12.10(C:I1)
N$26: IC12.6(B:O) IC12.9(C:I0)
RESET: JP3.3 ; also sheet 1,2,3,4
TRANSFER_PULSES: JP3.8 ; also sheet 1,2,3,4
VCC: C1.1 C2.1 C3.1 C4.1 C5.1 C6.1 C7.1 C8.1 C9.1 C10.1 C11.1 C12.1 C13.+ C14.+ C15.+ IC1.4(P:VCC) IC2.4(P:VCC) IC3.14(P:VCC) IC4.14(P:VCC) IC5.4(P:VCC) IC6.4(P:VCC) IC7.14(P:VCC) IC8.14(P:VCC) IC9.16(VCC) IC10.14(P:VCC) IC11.16(VCC) IC12.14(P:VCC) JP3.1 JP3.2 ; also sheet 1,2,3,4,5,6
Unconnected: IC12.11(D:O) IC12.12(D:I0) IC12.13(D:I1) JP3.5 JP3.6 JP3.7 JP3.9 JP3.10 JP3.11 JP3.13 JP3.14 JP3.15 JP3.17 JP3.18

### Notes on the sheet
- Released under the Creative Commons Attribution Share-Alike 3.0 License
  http://creativecommons.org/licenses/by-sa/3.0
  Design by: David Anders

## Library data of the parts
C1-C12 = resistor:C-US: CAPACITOR, American symbol
C13-C15 = resistor:CPOL-US: POLARIZED CAPACITOR, American symbol
IC1 IC2 IC5 IC6 = 74xx-us:74*73: Dual J-K FLIP FLOP, clear
IC3 IC4 IC7 IC8 IC12 = 74xx-us:74*08: Quad 2-input AND gate
IC9 IC11 = 74xx-us:74*157: Quadruple 2-line to 1-line data SELECTOR/MULTIPLEXER
IC10 = 74xx-us:74*32: Quad 2-input OR gate
JP1-JP3 = pinhead:PINHD-2X10: PIN HEADER

## Board
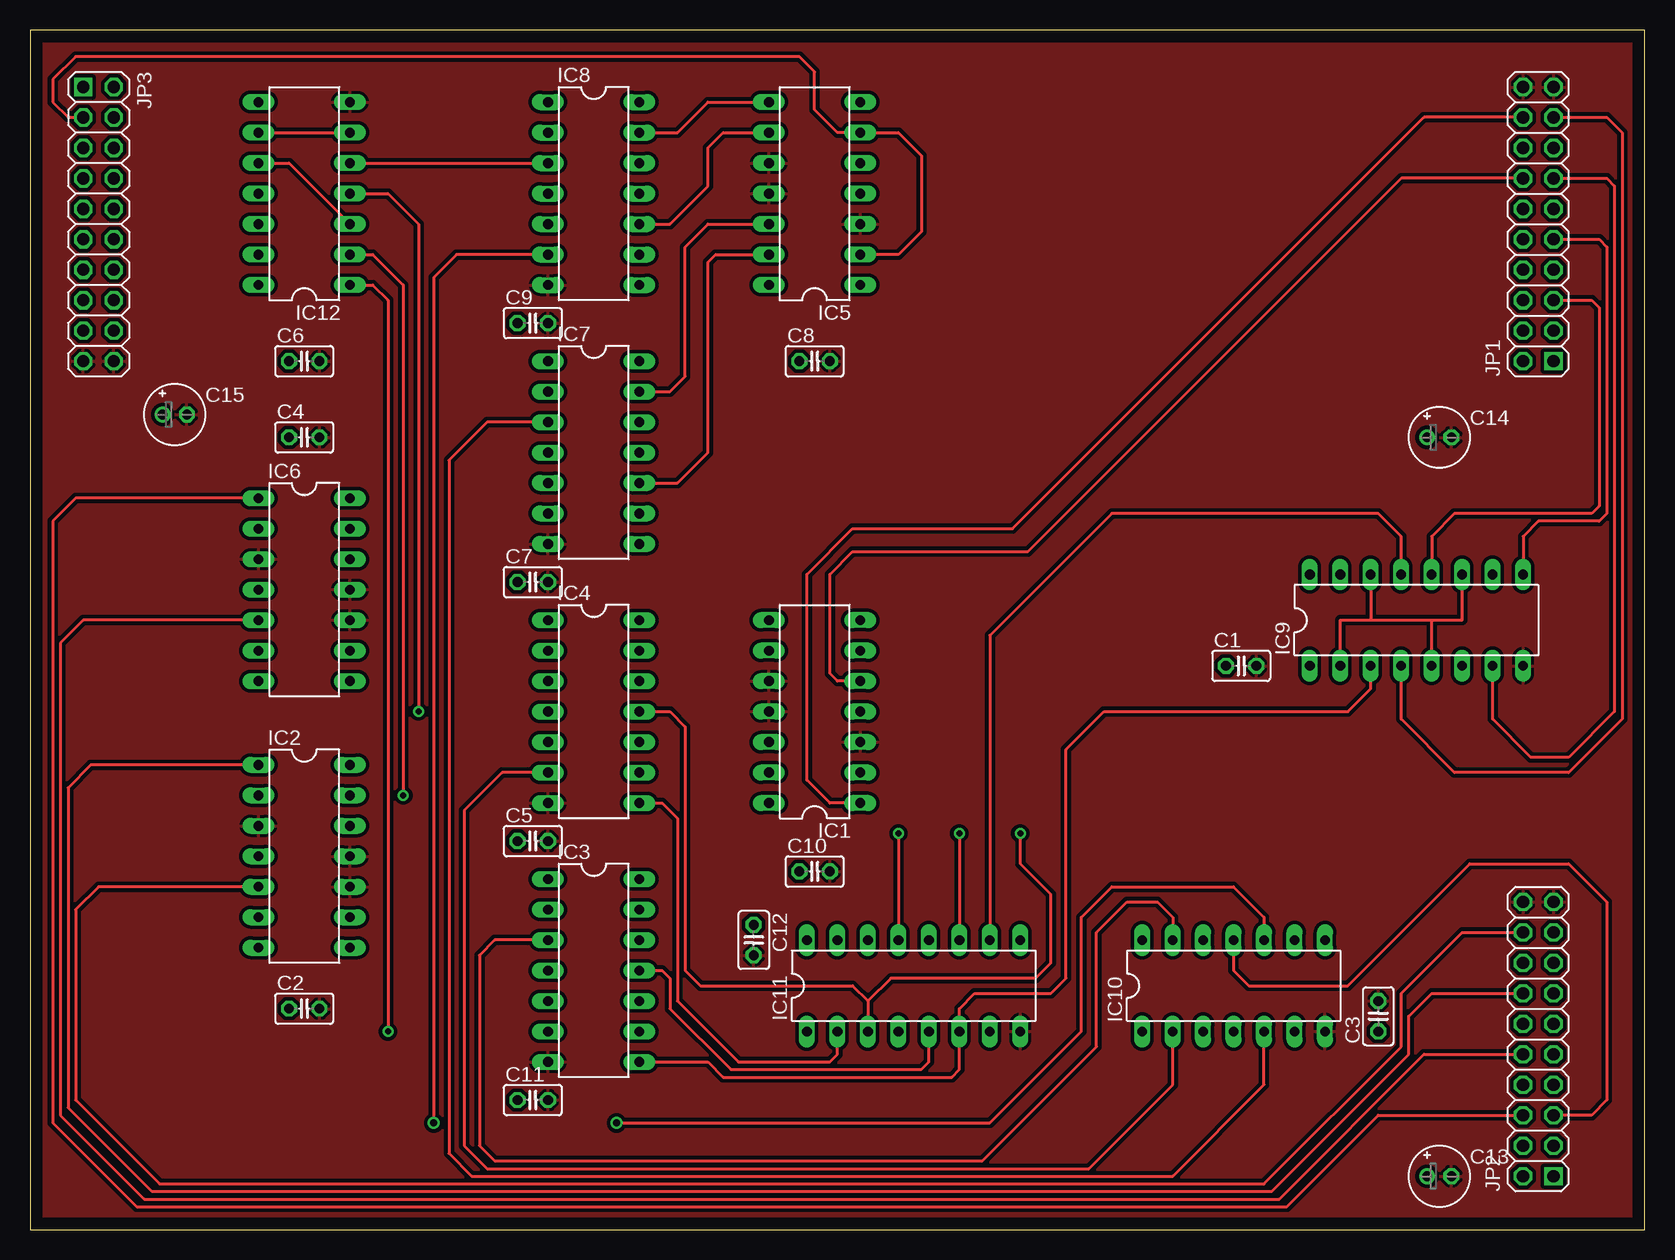
[diagram p7: board, top side]
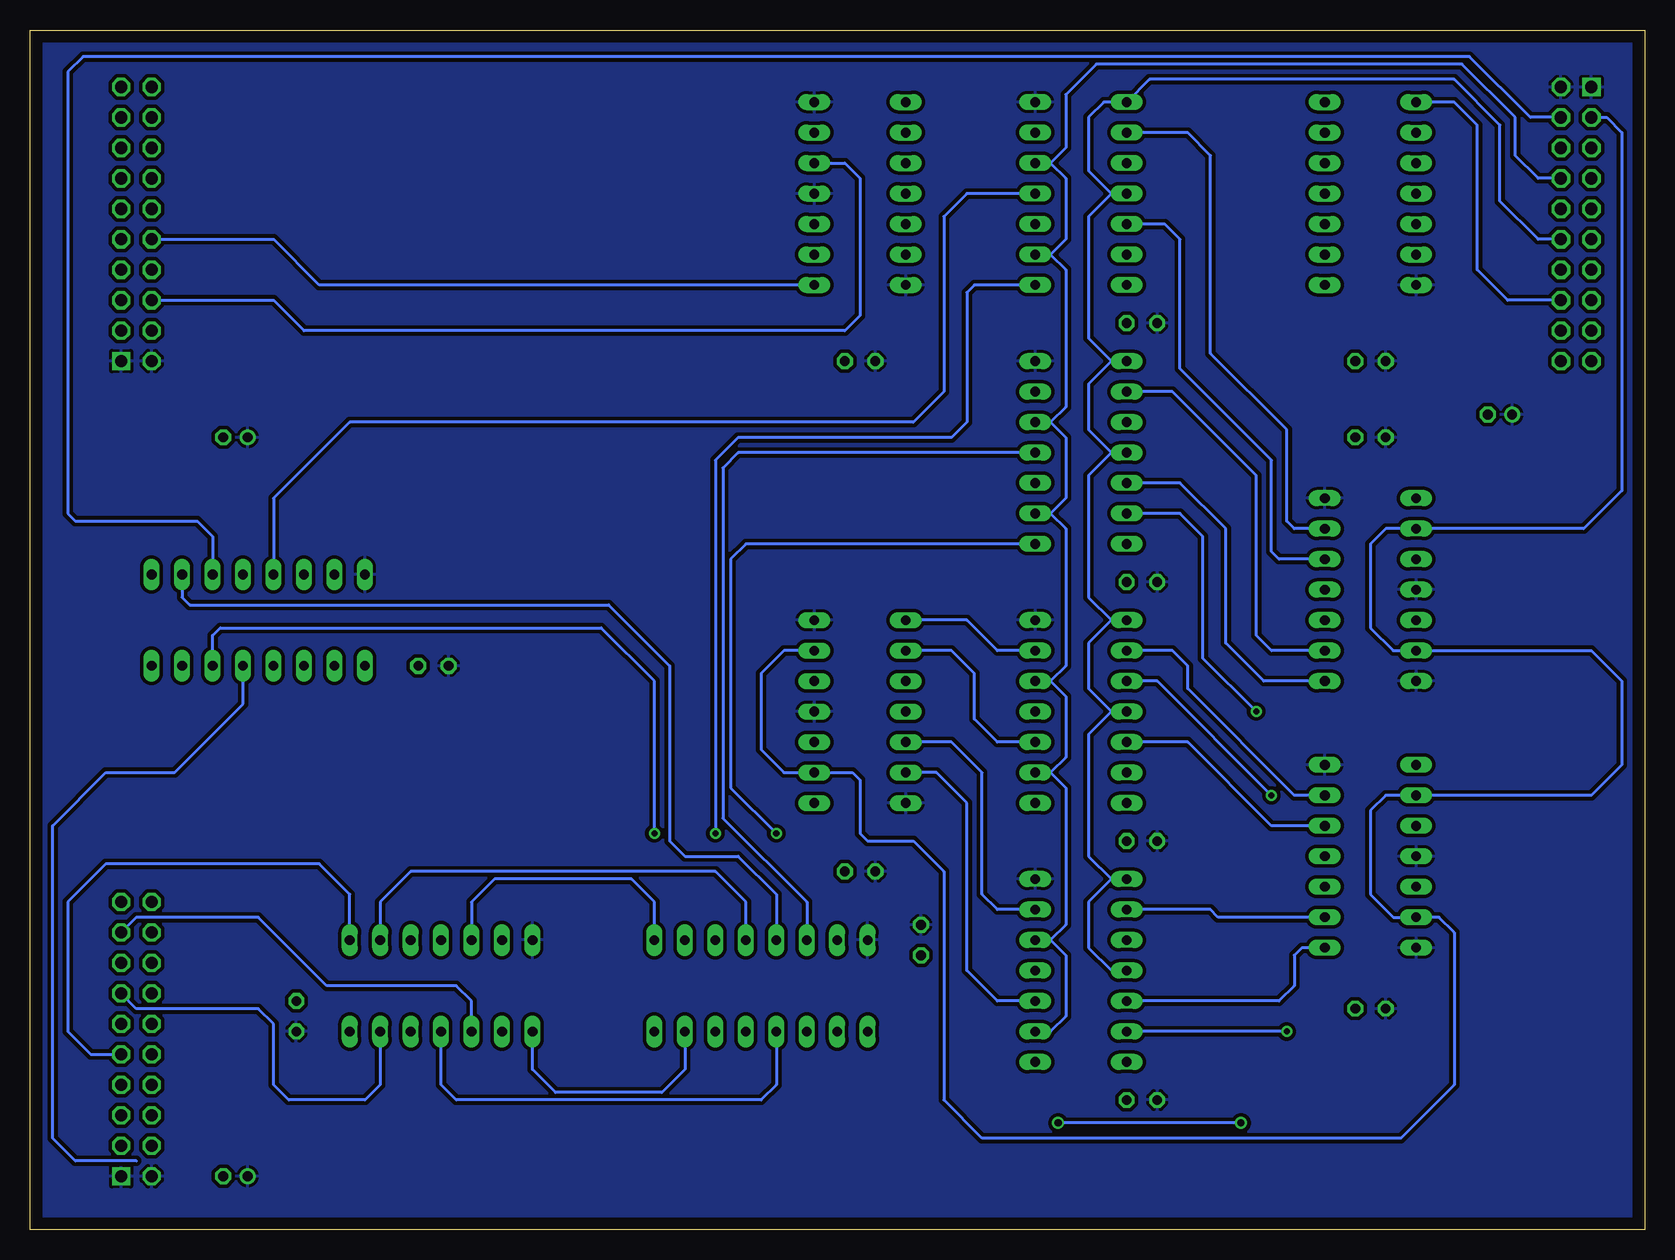
[diagram p8: board, bottom side, seen from below]

Size 134.6 x 100 mm. Coordinates in mm from the lower left corner, seen from the top.
Outline: 0,0 134.6,0 134.6,100 0,100 0,0
Copper layers (1*16): Top 0.035mm / dielectric 1.5mm / Bottom 0.035mm
Design rules "default *": minimum track width 10mil, minimum drill 20mil, track to track 8mil, track to pad 8mil, pad to pad 8mil, via to via 8mil, smd to smd 8mil, copper to edge 40mil, drill to drill 8mil, minimum pad ring 10mil, minimum via ring 8mil, stop-mask expansion 4mil, vias tented up to drill 0mil, thermal gap 10mil

### Footprints (pad centres in the part's own frame; a part is rotated, then mirrored left to right if it is on the bottom)
C025-025X050 = drill 0.813 octagon: 1 -1.27,0; 2 1.27,0
E2-5 = drill 0.813 pad 1.27: + -1.016,0 | drill 0.813 pad 1.27 octagon: - 1.016,0
DIL14 = drill 0.813 long: 1 -7.62,-3.81; 2 -5.08,-3.81; 3 -2.54,-3.81; 4 0,-3.81; 5 2.54,-3.81; 6 5.08,-3.81; 7 7.62,-3.81; 8 7.62,3.81; 9 5.08,3.81; 10 2.54,3.81; 11 0,3.81; 12 -2.54,3.81; 13 -5.08,3.81; 14 -7.62,3.81
DIL16 = drill 0.813 long: 1 -8.89,-3.81; 2 -6.35,-3.81; 3 -3.81,-3.81; 4 -1.27,-3.81; 5 1.27,-3.81; 6 3.81,-3.81; 7 6.35,-3.81; 8 8.89,-3.81; 9 8.89,3.81; 10 6.35,3.81; 11 3.81,3.81; 12 1.27,3.81; 13 -1.27,3.81; 14 -3.81,3.81; 15 -6.35,3.81; 16 -8.89,3.81
2X10 = drill 1.016 square: 1 -11.43,-1.27 | drill 1.016 octagon: 2 -11.43,1.27; 3 -8.89,-1.27; 4 -8.89,1.27; 5 -6.35,-1.27; 6 -6.35,1.27; 7 -3.81,-1.27; 8 -3.81,1.27; 9 -1.27,-1.27; 10 -1.27,1.27; 11 1.27,-1.27; 12 1.27,1.27; 13 3.81,-1.27; 14 3.81,1.27; 15 6.35,-1.27; 16 6.35,1.27; 17 8.89,-1.27; 18 8.89,1.27; 19 11.43,-1.27; 20 11.43,1.27

### Placement (x,y rotation side)
C1  100.97,46.99 0 top
C2  22.86,18.41 0 top
C3  112.39,17.78 90 top
C4  22.86,66.04 0 top
C5  41.91,32.38 0 top
C6  22.86,72.39 0 top
C7  41.91,53.98 0 top
C8  65.41,72.39 0 top
C9  41.91,75.56 0 top
C10  65.41,29.84 0 top
C11  41.91,10.79 0 top
C12  60.33,24.13 270 top
C13  117.47,4.45 0 top
C14  117.47,66.04 0 top
C15  12.06,67.94 0 top
IC1  65.41,43.18 90 top
IC2  22.86,31.11 270 top
IC3  46.99,21.59 270 top
IC4  46.99,43.18 270 top
IC5  65.41,86.36 90 top
IC6  22.86,53.34 270 top
IC7  46.99,64.77 270 top
IC8  46.99,86.36 270 top
IC9  115.57,50.8 0 top
IC10  100.33,20.32 0 top
IC11  73.66,20.32 0 top
IC12  22.86,86.36 90 top
JP1  125.73,83.82 90 top
JP2  125.73,15.88 90 top
JP3  5.71,83.82 270 top

### Tracks (layer width: path | path; a pad name or v marks a point on that pad's centre or on a via)
10A_PULSES
  Top 0.254: IC9.14 111.76,50.8 | 111.76,50.8 116.84,50.8 | 116.84,50.8 119.38,50.8 IC9.11 | IC9.5 116.84,50.8 | IC9.2 109.22,50.8 111.76,50.8
  Bottom 0.254: 125.73,5.71 130.81,5.71 132.72,7.62 132.72,33.66 128.27,38.1 122.56,38.1 116.84,43.81 IC9.5 | JP3.4 9.53,92.71 14.61,97.79 130.18,97.79 131.44,96.52 131.44,59.69 130.81,59.05 120.65,59.05 119.38,57.78 IC9.11
ADD0
  Top 0.254: IC3.11 52.7,21.59 53.34,20.95 53.34,18.41 58.42,13.34 74.3,13.34 74.93,13.97 IC11.5
ADD1
  Top 0.254: IC4.8 52.7,35.56 53.98,34.29 53.98,19.05 59.05,13.97 66.67,13.97 67.31,14.61 IC11.2
ADD2
  Bottom 0.254: IC11.14 69.85,27.3 76.83,34.29 76.83,63.5 75.56,64.77 IC7.11
ADD3  (via drill 0.51)
  Top 0.254: v77.47,33.02 IC11.11
  Bottom 0.254: IC8.8 55.88,78.74 56.52,78.11 56.52,67.31 57.78,66.04 75.56,66.04 77.47,64.14 v77.47,33.02
CARRY_COMPLETE
  Bottom 0.254: JP3.16 11.43,77.47 13.97,80.01 13.97,92.08 15.88,93.98 IC12.8
CARRY_PULSES
  Bottom 0.254: JP3.12 8.89,82.55 12.06,85.72 12.06,92.08 15.88,95.89 41.27,95.89 IC8.1 45.09,93.98 46.35,92.71 46.35,88.27 44.45,86.36 | IC8.4 44.45,86.36 | 44.45,86.36 46.35,84.45 46.35,74.3 44.45,72.39 | IC7.1 44.45,72.39 | 44.45,72.39 46.35,70.48 46.35,66.67 44.45,64.77 | IC7.4 44.45,64.77 | 44.45,64.77 46.35,62.87 46.35,52.7 44.45,50.8 | IC4.1 44.45,50.8 | 44.45,50.8 46.35,48.9 46.35,45.09 44.45,43.18 | IC4.4 44.45,43.18 | 44.45,43.18 46.35,41.27 46.35,31.11 44.45,29.21 | IC3.1 44.45,29.21 | 44.45,29.21 46.35,27.3 46.35,23.5 44.45,21.59 IC3.4
CARRYDONE0  (via drill 0.51)
  Top 0.254: IC12.1 28.57,78.74 29.84,77.47 v29.84,16.51
  Bottom 0.254: v29.84,16.51 IC3.6
CARRYDONE1  (via drill 0.51)
  Top 0.254: IC12.2 28.57,81.28 31.11,78.74 v31.11,36.2
  Bottom 0.254: v31.11,36.2 40.64,45.72 IC4.3
CARRYDONE2  (via drill 0.51)
  Top 0.254: IC12.4 29.84,86.36 32.38,83.82 v32.38,43.18
  Bottom 0.254: v32.38,43.18 36.83,47.62 36.83,57.78 38.73,59.69 IC7.6
CARRYDONE3
  Top 0.254: IC12.5 IC8.3
CARRYOUT0
  Top 0.254: IC3.3 38.73,24.13 37.47,22.86 37.47,6.99 38.73,5.71 79.38,5.71 88.9,15.24 88.9,24.77 91.44,27.3 93.98,27.3 95.25,26.04 IC10.13
CARRYOUT1
  Top 0.254: IC4.6 39.37,38.1 36.2,34.92 36.2,6.99 38.1,5.08 88.27,5.08 95.25,12.06 IC10.2
CARRYOUT2
  Top 0.254: IC7.3 38.1,67.31 34.92,64.14 34.92,6.35 36.83,4.45 95.25,4.45 102.87,12.06 IC10.5
CARRYOUT3  (via drill 0.6)
  Top 0.254: IC8.6 35.56,81.28 33.66,79.38 v33.66,8.89 | v48.9,8.89 80.01,8.89 87.63,16.51 87.63,26.04 90.17,28.57 100.33,28.57 102.87,26.04 IC10.10
  Bottom 0.254: v33.66,8.89 v48.9,8.89
COMP0
  Top 0.254: IC3.8 56.52,13.97 57.78,12.7 76.83,12.7 77.47,13.34 IC11.6 77.47,18.41 78.74,19.68 85.09,19.68 86.36,20.95 86.36,40.01 89.53,43.18 109.86,43.18 111.76,45.09 IC9.3
COMP1  (via drill 0.51)
  Top 0.254: 69.85,19.05 71.75,20.95 83.82,20.95 85.09,22.23 85.09,27.94 82.55,30.48 v82.55,33.02 | 69.85,19.05 IC11.3 | IC4.11 53.34,43.18 54.61,41.91 54.61,21.59 55.88,20.32 68.58,20.32 69.85,19.05
  Bottom 0.254: IC9.6 119.38,49.53 118.75,50.16 87,50.16 82.55,45.72 v82.55,33.02
COMP2  (via drill 0.51)
  Top 0.254: v72.39,33.02 IC11.13
  Bottom 0.254: IC9.10 121.92,52.7 121.28,52.07 86.36,52.07 81.28,46.99 81.28,32.38 80.01,31.11 75.56,31.11 72.39,27.94 IC11.13 | IC7.8 74.93,57.15 76.2,55.88 76.2,36.83 v72.39,33.02
COMP3
  Top 0.254: IC9.13 114.3,57.78 112.39,59.69 90.17,59.69 80.01,49.53 IC11.10
  Bottom 0.254: IC8.11 56.52,86.36 58.42,84.45 58.42,69.85 60.96,67.31 107.95,67.31 114.3,60.96 IC9.13
DKR0
  Bottom 0.254: IC10.3 97.79,19.05 99.06,20.32 109.86,20.32 115.57,26.04 125.73,26.04 JP2.17
DKR1
  Bottom 0.254: IC10.6 105.41,12.06 106.68,10.79 113.03,10.79 114.3,12.06 114.3,17.14 115.57,18.41 125.73,18.41 JP2.13
DKR2
  Bottom 0.254: IC10.8 107.95,27.94 110.49,30.48 128.27,30.48 131.44,27.3 131.44,16.51 129.54,14.61 JP2.9
DKR3
  Top 0.254: IC10.11 100.33,21.59 101.6,20.32 109.86,20.32 120.02,30.48 128.27,30.48 131.44,27.3 131.44,10.79 130.18,9.53 JP2.5
DKS0
  Top 0.254: IC9.4 114.3,42.55 118.75,38.1 128.27,38.1 132.72,42.55 132.72,91.44 131.44,92.71 JP1.17
DKS1
  Top 0.254: IC9.7 121.92,42.55 125.09,39.37 128.27,39.37 132.08,43.18 132.08,87 131.44,87.63 JP1.13
DKS2
  Top 0.254: IC9.9 124.46,57.78 125.73,59.05 130.81,59.05 131.44,59.69 131.44,81.92 130.81,82.55 JP1.9
DKS3
  Top 0.254: IC9.12 116.84,57.78 118.75,59.69 130.18,59.69 130.81,60.33 130.81,76.83 130.18,77.47 JP1.5
GND
  pour Top (isolate 0.305): 0.64,99.06 133.99,99.06 133.99,0.64 0.64,0.64
N$1
  Bottom 0.254: IC2.9 35.56,26.04 36.2,26.67 IC3.2
N$2
  Bottom 0.254: IC2.8 28.57,23.5 29.21,22.86 29.21,20.32 30.48,19.05 IC3.5
N$3
  Bottom 0.254: IC2.12 31.11,33.66 38.1,40.64 IC4.5
N$4
  Bottom 0.254: IC3.13 53.98,26.67 55.24,27.94 55.24,38.1 57.78,40.64 IC1.12
N$5
  Bottom 0.254: IC3.10 53.98,19.05 56.52,21.59 56.52,35.56 59.05,38.1 IC1.13
N$6
  Bottom 0.254: IC2.13 29.21,36.2 38.1,45.09 38.1,46.99 39.37,48.26 IC4.2
N$7
  Bottom 0.254: IC4.13 53.98,48.26 56.52,50.8 IC1.8
N$8
  Bottom 0.254: IC4.10 53.98,40.64 55.88,42.55 55.88,46.35 57.78,48.26 IC1.9
N$9
  Bottom 0.254: IC6.8 31.75,45.72 34.92,48.9 34.92,58.42 38.73,62.23 IC7.5
N$10
  Top 0.254: IC7.10 53.98,62.23 56.52,64.77 56.52,80.64 57.15,81.28 IC5.13
N$11
  Top 0.254: IC7.13 53.34,69.85 54.61,71.12 54.61,81.92 56.52,83.82 IC5.12
N$12
  Bottom 0.254: IC6.9 31.11,48.26 32.38,49.53 32.38,62.87 39.37,69.85 IC7.2
N$13
  Bottom 0.254: IC6.13 29.21,58.42 29.84,59.05 29.84,66.67 36.2,73.03 36.2,89.53 38.1,91.44 IC8.2
N$14
  Top 0.254: IC8.13 53.98,91.44 56.52,93.98 IC5.8
N$15
  Top 0.254: IC8.10 53.34,83.82 56.52,87 56.52,90.17 57.78,91.44 IC5.9
N$16
  Bottom 0.254: IC6.12 30.48,55.88 31.11,56.52 31.11,64.14 38.73,71.75 38.73,82.55 40.01,83.82 IC8.5
N$25
  Top 0.254: IC12.10 21.59,88.9 IC12.3
N$26
  Top 0.254: IC12.9 IC12.6
RESET
  Top 0.254: JP3.3 3.17,92.71 1.91,93.98 1.91,95.89 3.81,97.79 64.14,97.79 65.41,96.52 65.41,93.34 67.31,91.44 IC5.6 72.39,91.44 74.3,89.53 74.3,83.19 72.39,81.28 IC5.2
  Bottom 0.254: JP3.3 3.17,92.71 1.91,91.44 1.91,61.59 5.08,58.42 IC6.2 21.59,58.42 22.86,57.15 22.86,50.16 20.95,48.26 IC6.6 4.45,48.26 1.91,45.72 1.91,38.73 4.45,36.2 IC2.2 21.59,36.2 22.86,34.92 22.86,27.94 20.95,26.04 IC2.6 17.14,26.04 15.88,24.77 15.88,12.06 20.32,7.62 55.24,7.62 58.42,10.79 58.42,29.84 60.96,32.38 64.77,32.38 65.41,33.02 65.41,37.47 66.04,38.1 IC1.2 71.75,38.1 73.66,40.01 73.66,46.35 71.75,48.26 IC1.6
TRANSFER_PULSES
  Bottom 0.254: JP3.8 8.89,87.63 10.79,89.53 10.79,92.71 15.24,97.16 45.72,97.16 48.26,94.61 48.26,90.17 49.53,88.9 | IC8.12 49.53,88.9 | 49.53,88.9 48.26,87.63 48.26,82.55 49.53,81.28 | IC8.9 49.53,81.28 | 49.53,81.28 48.26,80.01 48.26,68.58 49.53,67.31 | IC7.12 49.53,67.31 | 49.53,67.31 48.26,66.04 48.26,60.96 49.53,59.69 | IC7.9 49.53,59.69 | 49.53,59.69 48.26,58.42 48.26,46.99 49.53,45.72 | IC4.12 49.53,45.72 | 49.53,45.72 48.26,44.45 48.26,39.37 49.53,38.1 | IC4.9 49.53,38.1 | 49.53,38.1 48.26,36.83 48.26,25.4 49.53,24.13 | IC3.12 49.53,24.13 | 49.53,24.13 48.26,22.86 48.26,17.78 49.53,16.51 IC3.9
TRANSFEROUT0
  Bottom 0.254: IC11.7 80.01,13.34 81.92,11.43 90.81,11.43 92.71,13.34 IC10.1
TRANSFEROUT1
  Bottom 0.254: IC11.4 72.39,12.06 73.66,10.79 99.06,10.79 100.33,12.06 IC10.4
TRANSFEROUT2
  Bottom 0.254: IC11.12 74.93,27.3 77.47,29.84 102.87,29.84 105.41,27.3 IC10.9
TRANSFEROUT3
  Bottom 0.254: IC11.9 82.55,27.3 84.45,29.21 95.89,29.21 97.79,27.3 IC10.12
VCC
  pour Bottom (isolate 0.305): 0.64,99.06 133.99,99.06 133.99,0.64 0.64,0.64
ZCR0
  Top 0.254: IC2.5 5.71,28.57 3.81,26.67 3.81,10.79 10.79,3.81 102.87,3.81 114.3,15.24 114.3,19.68 119.38,24.77 JP2.18
ZCR1
  Top 0.254: IC2.1 5.08,38.73 3.17,36.83 3.17,10.16 10.16,3.17 103.5,3.17 114.94,14.61 114.94,17.78 116.84,19.68 JP2.14
ZCR2
  Top 0.254: IC6.5 4.45,50.8 2.54,48.9 2.54,9.53 9.53,2.54 104.14,2.54 116.2,14.61 JP2.10
ZCR3
  Top 0.254: IC6.1 3.81,60.96 1.91,59.05 1.91,8.89 8.89,1.91 104.78,1.91 112.39,9.53 JP2.6
ZCS0
  Top 0.254: IC1.1 66.67,35.56 64.77,37.47 64.77,54.61 68.58,58.42 81.92,58.42 116.2,92.71 JP1.18
ZCS1
  Top 0.254: IC1.5 67.31,45.72 66.67,46.35 66.67,54.61 68.58,56.52 83.19,56.52 114.3,87.63 JP1.14
ZCS2
  Bottom 0.254: IC5.1 110.49,78.74 114.3,82.55 JP1.10
ZCS3
  Bottom 0.254: IC5.5 66.67,88.9 65.41,87.63 65.41,76.2 66.67,74.93 111.76,74.93 114.3,77.47 JP1.6